# Altium project P9XV1.0.PrjPCB (part 1 of 2)
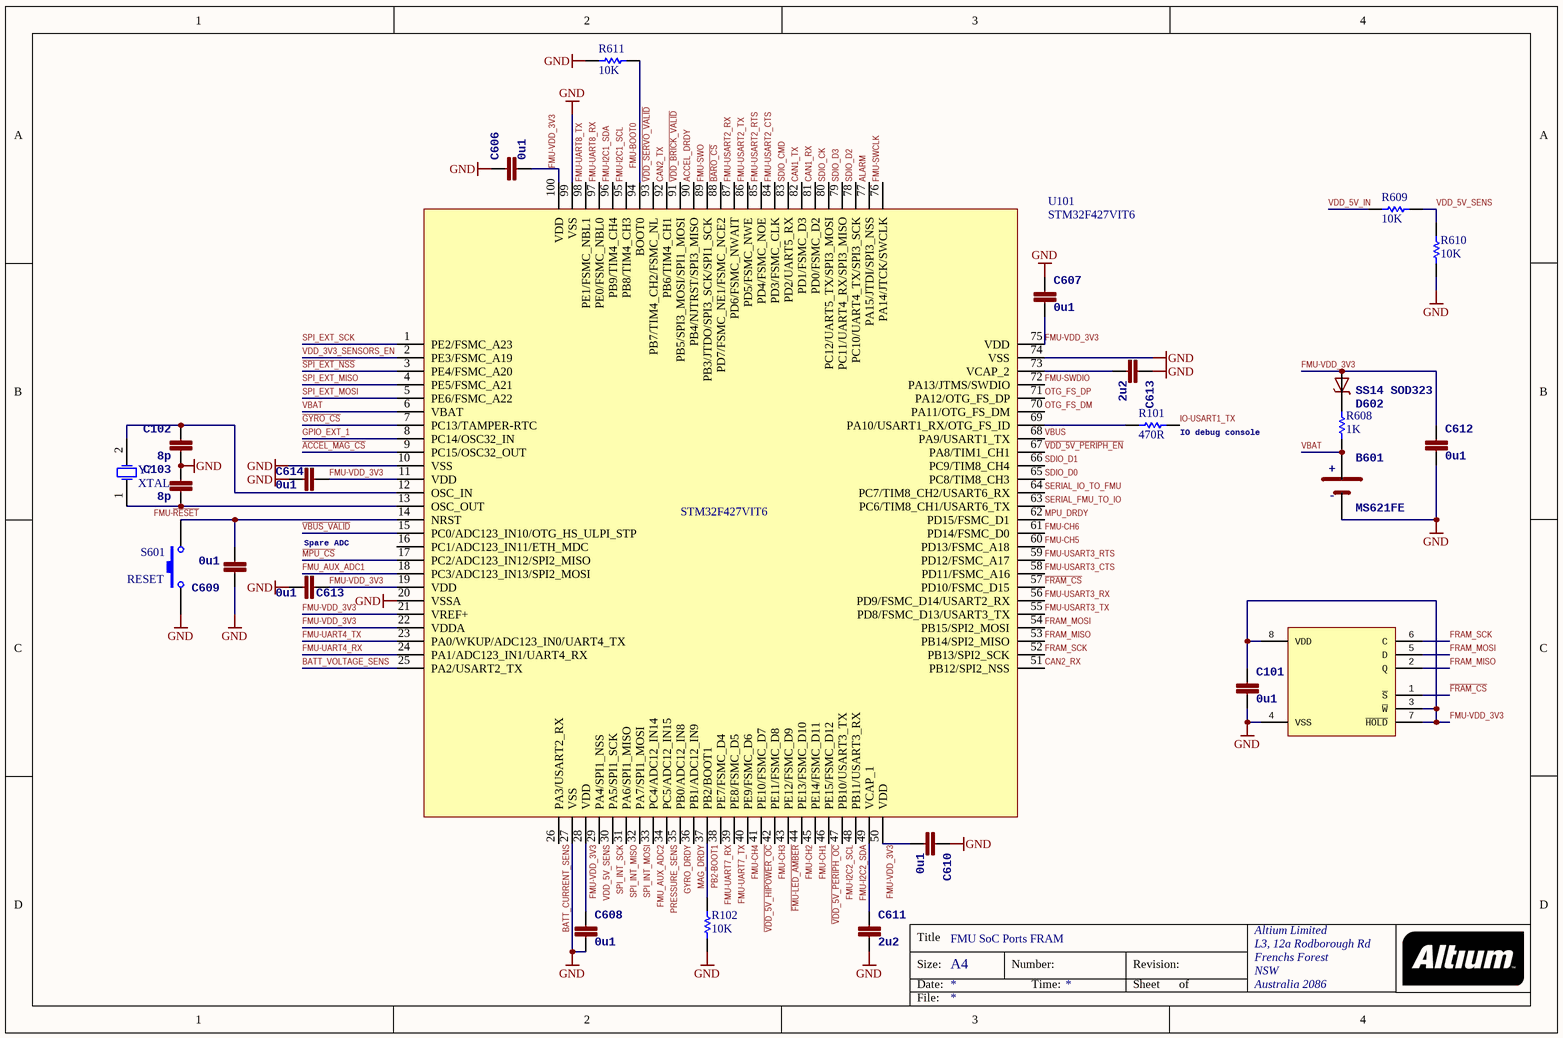
[diagram p0: F217Soc.SchDoc]
10 sheets, 241 parts. Net scope: global (net labels, ports and power ports of the same name join across sheets).
Board file: P9XV1.0.PcbDoc
Sheets:
  F217Soc.SchDoc
  FMU IO ports.SchDoc
  IMU.SchDoc
  F427&IMU Power Supply.SchDoc
  LEDs etc.SchDoc
  F100SoC.SchDoc
  Servo interface.SchDoc
  IO Power Supply.SchDoc
  Power SUM.SchDoc
  Test and Fiducials.SchDoc

## Sheet F217Soc.SchDoc
size A4; Organization: Altium Limited; Address1: L3, 12a Rodborough Rd; Address2: Frenchs Forest; Address3: NSW; Address4: Australia 2086

### Parts
(Parts that share a designator on the sheet are numbered #1, #2 ... from top to bottom, then left to right.)
B601  >NAME: B601  [MS621FE]  (hidden comment: MS621FE)
C101  >NAME: C101  [0603-CAP]  (hidden comment: 0u1)
C102  >NAME: C102  [0603-CAP]  (hidden comment: 8p)
C103  >NAME: C103  [0603-CAP]  (hidden comment: 8p)
C606  >NAME: C606  [0603-CAP]  (hidden comment: 0u1)
C607  >NAME: C607  [0603-CAP]  (hidden comment: 0u1)
C608#1  >NAME: C614  [0603-CAP]  (hidden comment: 0u1)
C608#2  >NAME: C613  [0603-CAP]  (hidden comment: 0u1)
C608#3  >NAME: C608  [0603-CAP]  (hidden comment: 0u1)
C609  >NAME: C609  [0603-CAP]  (hidden comment: 0u1)
C610  >NAME: C610  [0603-CAP]  (hidden comment: 0u1)
C611  >NAME: C611  [0603-CAP]  (hidden comment: 2u2)
C612  >NAME: C612  [0603-CAP]  (hidden comment: 0u1)
C613  >NAME: C613  [0603-CAP]  (hidden comment: 2u2)
D602  SS14 SOD323  [SOD323]
R101  value 470R  [AXIAL-0.5]  (hidden comment: Res Semi)
R102  value 10K  [AXIAL-0.5]  (hidden comment: Res Semi)
R608  value 1K  [AXIAL-0.5]  (hidden comment: Res Semi)
R609  value 10K  [AXIAL-0.5]  (hidden comment: Res Semi)
R610  value 10K  [AXIAL-0.5]  (hidden comment: Res Semi)
R611  value 10K  [AXIAL-0.5]  (hidden comment: Res Semi)
S601  RESET  [SPST-2]
U101  STM32F427VIT6
U102  FM25V01  [SO08]  (value not drawn)
Y?#1  XTAL  [R38]

### Nets
GND: B601.2(NEG) C101.P$2 C102.P$2 C103.P$1 C606.P$1 C607.P$1 C608#1.P$2 C608#2.P$1 C608#3.P$2 C609.P$1 C610.P$1 C611.P$2 C612.P$2 C613.P$1 R102.1 R610.1 R611.2 S601.1 U101.10(VSS) U101.20(VSSA) U101.27(VSS) U101.74(VSS) U101.99(VSS) U102.4(VSS)
~{ACCEL_MAG_CS}: U101.9(PC15/OSC32_OUT)
ACCEL_DRDY: U101.90(PB4/NJTRST/SPI3_MISO)
ALARM: U101.77(PA15/JTDI/SPI3_NSS)
~{BARO_CS}: U101.88(PD7/FSMC_NE1/FSMC_NCE2)
BATT_CURRENT_SENS: U101.26(PA3/USART2_RX)
BATT_VOLTAGE_SENS: U101.25(PA2/USART2_TX)
CAN1_RX: U101.81(PD0/FSMC_D2)
CAN1_TX: U101.82(PD1/FSMC_D3)
CAN2_RX: U101.51(PB12/SPI2_NSS)
CAN2_TX: U101.92(PB6/TIM4_CH1)
~{FMU-LED_AMBER}: U101.43(PE12/FSMC_D9)
~{FRAM_CS}: U101.57(PD10/FSMC_D15) U102.1(~{S})
FMU-BOOT0: R611.1 U101.94(BOOT0)
FMU-CH1: U101.45(PE14/FSMC_D11)
FMU-CH2: U101.44(PE13/FSMC_D10)
FMU-CH3: U101.42(PE11/FSMC_D8)
FMU-CH4: U101.40(PE9/FSMC_D6)
FMU-CH5: U101.60(PD13/FSMC_A18)
FMU-CH6: U101.61(PD14/FSMC_D0)
FMU-I2C1_SCL: U101.95(PB8/TIM4_CH3)
FMU-I2C1_SDA: U101.96(PB9/TIM4_CH4)
FMU-I2C2_SCL: U101.47(PB10/USART3_TX)
FMU-I2C2_SDA: U101.48(PB11/USART3_RX)
FMU-SWCLK: U101.76(PA14/JTCK/SWCLK)
FMU-SWDIO: U101.72(PA13/JTMS/SWDIO)
FMU-SWO: U101.89(PB3/JTDO/SPI3_SCK/SPI1_SCK)
FMU-UART4_RX: U101.24(PA1/ADC123_IN1/UART4_RX)
FMU-UART4_TX: U101.23(PA0/WKUP/ADC123_IN0/UART4_TX)
FMU-UART7_RX: U101.38(PE7/FSMC_D4)
FMU-UART7_TX: U101.39(PE8/FSMC_D5)
FMU-UART8_RX: U101.97(PE0/FSMC_NBL0)
FMU-UART8_TX: U101.98(PE1/FSMC_NBL1)
FMU-USART2_CTS: U101.84(PD3/FSMC_CLK)
FMU-USART2_RTS: U101.85(PD4/FSMC_NOE)
FMU-USART2_RX: U101.87(PD6/FSMC_NWAIT)
FMU-USART2_TX: U101.86(PD5/FSMC_NWE)
FMU-USART3_CTS: U101.58(PD11/FSMC_A16)
FMU-USART3_RTS: U101.59(PD12/FSMC_A17)
FMU-USART3_RX: U101.56(PD9/FSMC_D14/USART2_RX)
FMU-USART3_TX: U101.55(PD8/FSMC_D13/USART3_TX)
FMU-VDD_3V3: C101.P$1 C606.P$2 C607.P$2 C608#1.P$1 C608#2.P$2 C608#3.P$1 C610.P$2 C612.P$1 D602.A U101.11(VDD) U101.19(VDD) U101.21(VREF+) U101.22(VDDA) U101.28(VDD) U101.50(VDD) U101.75(VDD) U101.100(VDD) U102.3(~{W}) U102.7(~{HOLD}) U102.8(VDD)
FMU_AUX_ADC1: U101.18(PC3/ADC123_IN13/SPI2_MOSI)
FMU_AUX_ADC2: U101.33(PC4/ADC12_IN14)
FRAM_MISO: U101.53(PB14/SPI2_MISO) U102.2(Q)
FRAM_MOSI: U101.54(PB15/SPI2_MOSI) U102.5(D)
FRAM_SCK: U101.52(PB13/SPI2_SCK) U102.6(C)
~{GYRO_CS}: U101.7(PC13/TAMPER-RTC)
GPIO_EXT_1: U101.8(PC14/OSC32_IN)
GYRO_DRDY: U101.35(PB0/ADC12_IN8)
IO-USART1_TX: R101.1
~{MPU_CS}: U101.17(PC2/ADC123_IN12/SPI2_MISO)
MAG_DRDY: U101.36(PB1/ADC12_IN9)
MPU_DRDY: U101.62(PD15/FSMC_D1)
OTG_FS_DM: U101.70(PA11/OTG_FS_DM)
OTG_FS_DP: U101.71(PA12/OTG_FS_DP)
PB2-BOOT1: R102.2 U101.37(PB2/BOOT1)
PRESSURE_SENS: U101.34(PC5/ADC12_IN15)
~{SPI_EXT_NSS}: U101.3(PE4/FSMC_A20)
SDIO_CK: U101.80(PC12/UART5_TX/SPI3_MOSI)
SDIO_CMD: U101.83(PD2/UART5_RX)
SDIO_D0: U101.65(PC8/TIM8_CH3)
SDIO_D1: U101.66(PC9/TIM8_CH4)
SDIO_D2: U101.78(PC10/UART4_TX/SPI3_SCK)
SDIO_D3: U101.79(PC11/UART4_RX/SPI3_MISO)
SERIAL_FMU_TO_IO: U101.63(PC6/TIM8_CH1/USART6_TX)
SERIAL_IO_TO_FMU: U101.64(PC7/TIM8_CH2/USART6_RX)
SPI_EXT_MISO: U101.4(PE5/FSMC_A21)
SPI_EXT_MOSI: U101.5(PE6/FSMC_A22)
SPI_EXT_SCK: U101.1(PE2/FSMC_A23)
SPI_INT_MISO: U101.31(PA6/SPI1_MISO)
SPI_INT_MOSI: U101.32(PA7/SPI1_MOSI)
SPI_INT_SCK: U101.30(PA5/SPI1_SCK)
~{VBUS_VALID}: U101.15(PC0/ADC123_IN10/OTG_HS_ULPI_STP)
~{VDD_5V_HIPOWER_OC}: U101.41(PE10/FSMC_D7)
~{VDD_5V_PERIPH_EN}: U101.67(PA8/TIM1_CH1)
~{VDD_5V_PERIPH_OC}: U101.46(PE15/FSMC_D12)
~{VDD_BRICK_VALID}: U101.91(PB5/SPI3_MOSI/SPI1_MOSI)
~{VDD_SERVO_VALID}: U101.93(PB7/TIM4_CH2/FSMC_NL)
VBAT: B601.1(POS) R608.1 U101.6(VBAT)
VBUS: U101.68(PA9/USART1_TX)
VDD_3V3_SENSORS_EN: U101.2(PE3/FSMC_A19)
VDD_5V_IN: R609.2  [project net FMU-VDD_5V5]
VDD_5V_SENS: R609.1 R610.2 U101.29(PA4/SPI1_NSS)
NetC102_P$1: C102.P$1 U101.12(OSC_IN) Y?#1.2(OSC2)
NetC103_P$2: C103.P$2 U101.13(OSC_OUT) Y?#1.1(OSC1)
NetC609_P$2: C609.P$2 S601.2 U101.14(NRST)
NetC611_P$1: C611.P$1 U101.49(VCAP_1)
NetC613_P$2: C613.P$2 U101.73(VCAP_2)
NetD602_C: D602.C R608.2
NetR101_2: R101.2 U101.69(PA10/USART1_RX/OTG_FS_ID)

Not connected (* = marked no-connect by the designer): U101 16(PC1/ADC123_IN11/ETH_MDC)

### Notes on the sheet
- (near R101) IO debug console
- (near C608#2) Spare ADC
- FMU SoC Ports FRAM
- Labels drawn without touching a wire or pin: FMU-~{RESET}
- Title
- Size:
- Date:
- A4
- Number:
- Time:
- Revision:
- Sheet
- of
- File:

### Library data of the parts
B601 = MS621FE: <b>SEIKO 6.8mm Rechargeable 3V lithium battery<b> / <br> / <br> / <b>If discontinued or not available, similar devices are available from Panasonic and Sanyo, usually direct replacements.<b>; PARTNO: MS621FE-FL11E; DATASHEET: http://speed.sii.co.jp/data/file_PRODUCT_MASTER_50112_TITLE_IMAGESP.pdf; LINK: http://search.digikey.com/us/en/products/MS621FE-FL11E/728-1057-ND/1889208; MFGPN: MS621FE; +: +; -: -; >VALUE: MS621FE
C101 C606 C607 C608#1-C608#3 C609 C610 C612 = CAP0402: <b>Capacitor</b> / Standard 0603 ceramic capacitor, and 0.1" leaded capacitor.; PARTNO: CC0402ZRY5V7BB104; >VALUE: 0u1
C102 C103 = CAP0402: <b>Capacitor</b> / Standard 0603 ceramic capacitor, and 0.1" leaded capacitor.; PARTNO: C1005C0G1H080C; >VALUE: 8p
C611 C613 = CAP0603: <b>Capacitor</b> / Standard 0603 ceramic capacitor, and 0.1" leaded capacitor.; PARTNO: C1608X6S1C225K080AC; >VALUE: 2u2
D602 = DIODE-SCHOTTKY_SOD323: Schottky barrier diode in DO214AC, e.g. Fairchild SS14.
R101 R102 R608-R611 = Res Semi: Semiconductor Resistor; Published: 8-Jun-2000; LatestRevisionDate: 17-Jul-2002; LatestRevisionNote: Re-released for DXP Platform.; PackageReference: AXIAL-0.5; Publisher: Altium Limited; PackageDescription: Axial Device, Thru-Hole; 2 Leads; 0.5 in Pin Spacing
S601 = SW-PB: Switch; Published: 24-Mar-1999; LatestRevisionDate: 17-Jul-2002; LatestRevisionNote: Re-released for DXP Platform.; PackageReference: SPST-2; Publisher: Altium Limited; PackageDescription: Switch; 2 Leads
U102 = FM25V01: <b>FM25V01 128Kb Serial 3V F-RAM Memory</b>; PARTNO: FM25V01-G; DATASHEET: http://www.ramtron.com/files/datasheets/FM25V01_ds.pdf; LINK: http://www.digikey.com/product-detail/en/FM25V01-GTR/1140-1026-1-ND/2809832; MFGPN: FM25V01
Y?#1 = XTAL: Crystal Oscillator; Published: 8-Jun-2000; LatestRevisionDate: 17-Jul-2002; LatestRevisionNote: Re-released for DXP Platform.; PackageReference: R38; Publisher: Altium Limited; PackageDescription: Crystal, Thru-Hole; 2 Leads; Body 3.1 x 8.2 mm (Dia.xH)

## Sheet FMU IO ports.SchDoc
size A4; Organization: Altium Limited; Address1: L3, 12a Rodborough Rd; Address2: Frenchs Forest; Address3: NSW; Address4: Australia 2086
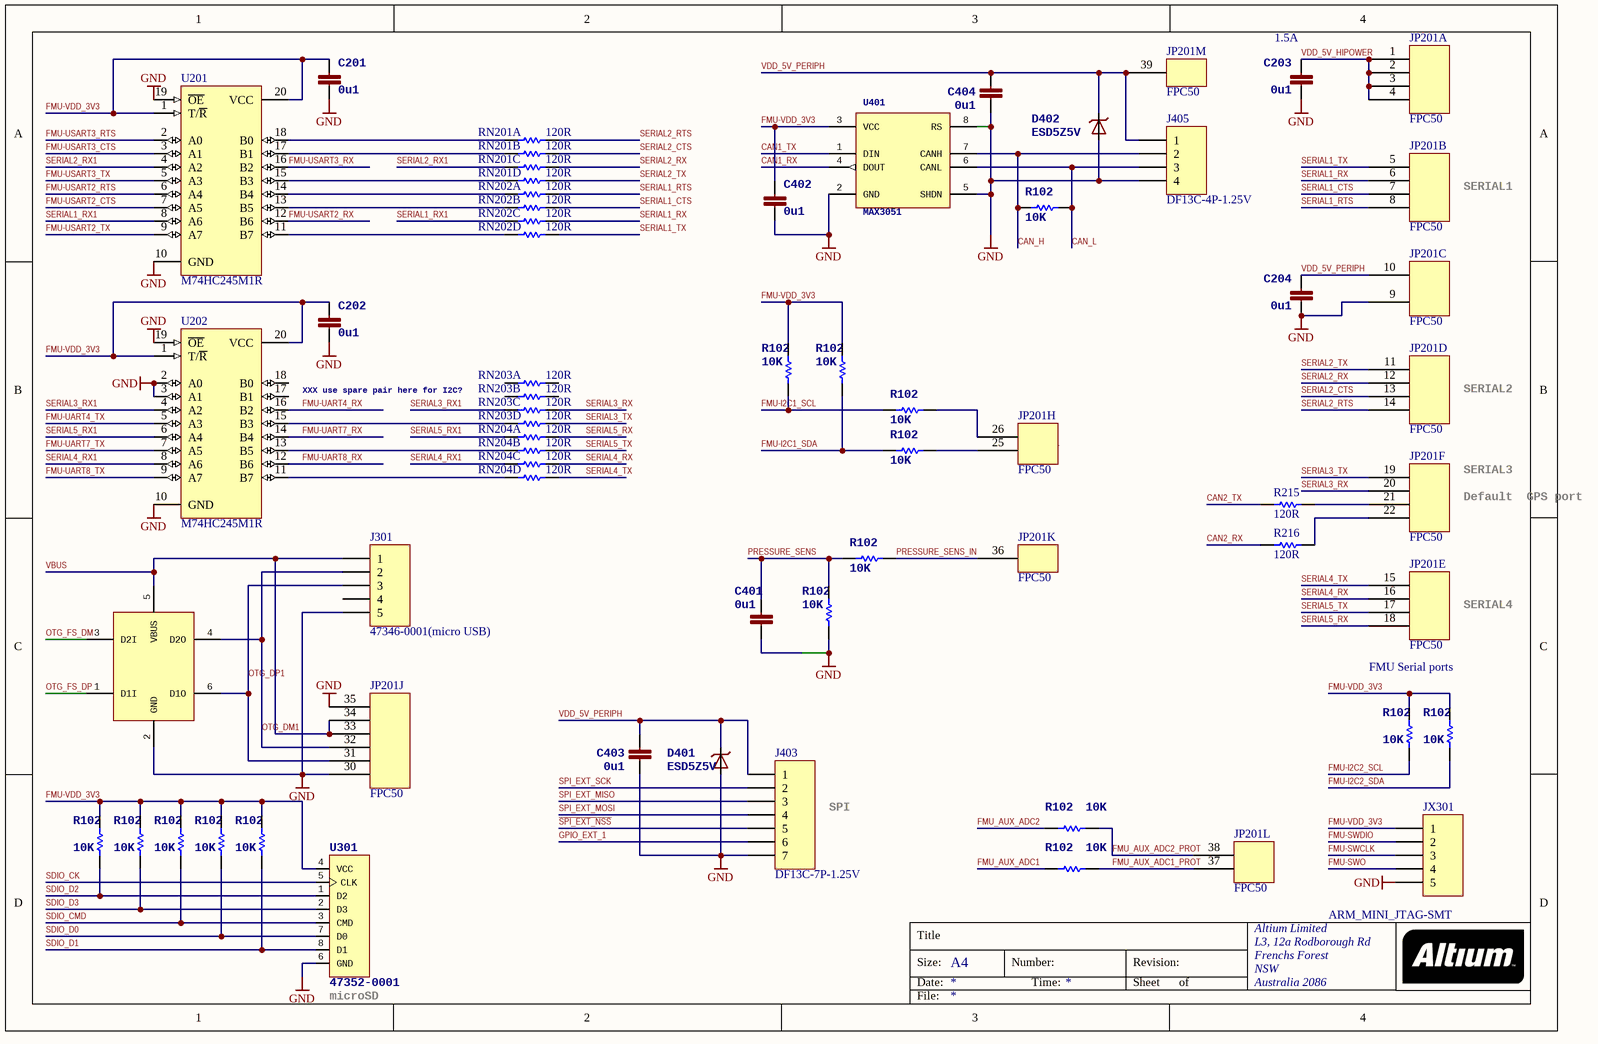
[diagram p1: FMU IO ports.SchDoc]

### Parts
C201  >NAME: C201  [0603-CAP]  (hidden comment: 0u1)
C202  >NAME: C202  [0603-CAP]  (hidden comment: 0u1)
C203  >NAME: C203  [0603-CAP]  (hidden comment: 0u1)
C204  >NAME: C204  [0603-CAP]  (hidden comment: 0u1)
C401  >NAME: C401  [0603-CAP]  (hidden comment: 0u1)
C402  >NAME: C402  [0603-CAP]  (hidden comment: 0u1)
C403  >NAME: C403  [0603-CAP]  (hidden comment: 0u1)
C404  >NAME: C404  [0603-CAP]  (hidden comment: 0u1)
D401  ESD5Z5V  [SOD523]
D402  ESD5Z5V  [SOD523]
J301  47346-0001(micro USB)  [HDR1X5]
J403  DF13C-7P-1.25V  [HDR1X7]
J405  DF13C-4P-1.25V  [HDR1X4]
JP201  FPC50  [FPC-0.5-50下接带锁]  (parts A,B,C,D,E,F,H,J,K,L,M of 16)
JX301  ARM_MINI_JTAG-SMT  [HDR1X5]
R215  value 120R  [AXIAL-0.5]  (hidden comment: Res Semi)
R216  value 120R  [AXIAL-0.5]  (hidden comment: Res Semi)
R301  >NAME: R102  [0603-RES]  (hidden comment: 10K)
R302  >NAME: R102  [0603-RES]  (hidden comment: 10K)
R303  >NAME: R102  [0603-RES]  (hidden comment: 10K)
R304  >NAME: R102  [0603-RES]  (hidden comment: 10K)
R305  >NAME: R102  [0603-RES]  (hidden comment: 10K)
R306  >NAME: R102  [0603-RES]  (hidden comment: 10K)
R307  >NAME: R102  [0603-RES]  (hidden comment: 10K)
R401  >NAME: R102  [0603-RES]  (hidden comment: 10K)
R402  >NAME: R102  [0603-RES]  (hidden comment: 10K)
R403  >NAME: R102  [0603-RES]  (hidden comment: 10K)
R404  >NAME: R102  [0603-RES]  (hidden comment: 10K)
R405  >NAME: R102  [0603-RES]  (hidden comment: 10K)
R406  >NAME: R102  [0603-RES]  (hidden comment: 10K)
R407  >NAME: R102  [0603-RES]  (hidden comment: 10K)
R408  >NAME: R102  [0603-RES]  (hidden comment: 10K)
R409  >NAME: R102  [0603-RES]  (hidden comment: 10K)
RN201A  value 120R  [AXIAL-0.5]  (hidden comment: Res Semi)
RN201B  value 120R  [AXIAL-0.5]  (hidden comment: Res Semi)
RN201C  value 120R  [AXIAL-0.5]  (hidden comment: Res Semi)
RN201D  value 120R  [AXIAL-0.5]  (hidden comment: Res Semi)
RN202A  value 120R  [AXIAL-0.5]  (hidden comment: Res Semi)
RN202B  value 120R  [AXIAL-0.5]  (hidden comment: Res Semi)
RN202C  value 120R  [AXIAL-0.5]  (hidden comment: Res Semi)
RN202D  value 120R  [AXIAL-0.5]  (hidden comment: Res Semi)
RN203A  value 120R  [AXIAL-0.5]  (hidden comment: Res Semi)
RN203B  value 120R  [AXIAL-0.5]  (hidden comment: Res Semi)
RN203C  value 120R  [AXIAL-0.5]  (hidden comment: Res Semi)
RN203D  value 120R  [AXIAL-0.5]  (hidden comment: Res Semi)
RN204A  value 120R  [AXIAL-0.5]  (hidden comment: Res Semi)
RN204B  value 120R  [AXIAL-0.5]  (hidden comment: Res Semi)
RN204C  value 120R  [AXIAL-0.5]  (hidden comment: Res Semi)
RN204D  value 120R  [AXIAL-0.5]  (hidden comment: Res Semi)
U201  M74HC245M1R  [TSSOP20]
U202  M74HC245M1R  [TSSOP20]
U301  >NAME: U301  >VALUE: 47352-0001  [MICROSD]  (hidden comment: 2908-05WB-MG)
U302  NUF2042XV6  [SOT23-6]  (value not drawn)
U401  >NAME: U401  [SOT23-8]  (hidden comment: MAX3051)

### Nets
GND: C201.P$2 C202.P$2 C203.P$2 C204.P$2 C401.P$2 C402.P$2 C403.P$2 C404.P$2 D401.A D402.A J301.5 J403.7 J405.4 JP201.9 JP201.30 JP201.35 JX301.5 R403.P$1 U201.10(GND) U201.19(~{OE}) U202.2(A0) U202.3(A1) U202.10(GND) U202.19(~{OE}) U301.6(GND) U302.2(GND) U401.2(GND) U401.5(SHDN) U401.8(RS)
CAN1_RX: U401.4(DOUT)
CAN1_TX: U401.1(DIN)
CAN2_RX: R216.1
CAN2_TX: R215.1
CAN_H: J405.2 R409.P$1 U401.7(CANH)
CAN_L: J405.3 R409.P$2 U401.6(CANL)
FMU-I2C1_SCL: R401.P$1 R404.P$1
FMU-I2C1_SDA: R402.P$1 R405.P$1
FMU-I2C2_SCL: R306.P$1
FMU-I2C2_SDA: R307.P$1
FMU-SWCLK: JX301.3
FMU-SWDIO: JX301.2
FMU-SWO: JX301.4
FMU-UART4_RX: U202.16(B2)
FMU-UART4_TX: U202.5(A3)
FMU-UART7_RX: U202.14(B4)
FMU-UART7_TX: U202.7(A5)
FMU-UART8_RX: U202.12(B6)
FMU-UART8_TX: U202.9(A7)
FMU-USART2_CTS: U201.7(A5)
FMU-USART2_RTS: U201.6(A4)
FMU-USART2_RX: U201.12(B6)
FMU-USART2_TX: U201.9(A7)
FMU-USART3_CTS: U201.3(A1)
FMU-USART3_RTS: U201.2(A0)
FMU-USART3_RX: U201.16(B2)
FMU-USART3_TX: U201.5(A3)
FMU-VDD_3V3: C201.P$1 C202.P$1 C402.P$1 JX301.1 R301.P$2 R302.P$2 R303.P$2 R304.P$2 R305.P$2 R306.P$2 R307.P$2 R401.P$2 R402.P$2 U201.1(T/~{R}) U201.20(VCC) U202.1(T/~{R}) U202.20(VCC) U301.4(VCC) U401.3(VCC)
FMU_AUX_ADC1: R408.P$1
FMU_AUX_ADC1_PROT: JP201.37 R408.P$2
FMU_AUX_ADC2: R407.P$1
FMU_AUX_ADC2_PROT: JP201.38 R407.P$2
GPIO_EXT_1: J403.6
OTG_DM1: J301.2 JP201.32 U302.4(D2O)
OTG_DP1: J301.3 JP201.31 U302.6(D1O)
OTG_FS_DM: U302.3(D2I)
OTG_FS_DP: U302.1(D1I)
PRESSURE_SENS: C401.P$1 R403.P$2 R406.P$1
PRESSURE_SENS_IN: JP201.36 R406.P$2
~{SPI_EXT_NSS}: J403.5
SDIO_CK: U301.5(CLK)
SDIO_CMD: R303.P$1 U301.3(CMD)
SDIO_D0: R304.P$1 U301.7(D0)
SDIO_D1: R305.P$1 U301.8(D1)
SDIO_D2: R301.P$1 U301.1(D2)
SDIO_D3: R302.P$1 U301.2(D3)
SERIAL1_CTS: JP201.7 RN202B.1
SERIAL1_RTS: JP201.8 RN202A.1
SERIAL1_RX: JP201.6 RN202C.1
SERIAL1_RX1: RN202C.2 U201.8(A6)
SERIAL1_TX: JP201.5 RN202D.1
SERIAL2_CTS: JP201.13 RN201B.1
SERIAL2_RTS: JP201.14 RN201A.1
SERIAL2_RX: JP201.12 RN201C.1
SERIAL2_RX1: RN201C.2 U201.4(A2)
SERIAL2_TX: JP201.11 RN201D.1
SERIAL3_RX: JP201.20 RN203C.1
SERIAL3_RX1: RN203C.2 U202.4(A2)
SERIAL3_TX: JP201.19 RN203D.1
SERIAL4_RX: JP201.16 RN204C.1
SERIAL4_RX1: RN204C.2 U202.8(A6)
SERIAL4_TX: JP201.15 RN204D.1
SERIAL5_RX: JP201.18 RN204A.1
SERIAL5_RX1: RN204A.2 U202.6(A4)
SERIAL5_TX: JP201.17 RN204B.1
SPI_EXT_MISO: J403.3
SPI_EXT_MOSI: J403.4
SPI_EXT_SCK: J403.2
VBUS: J301.1 JP201.33 JP201.34 U302.5(VBUS)
VDD_5V_HIPOWER: C203.P$1 JP201.1 JP201.2 JP201.3 JP201.4
VDD_5V_PERIPH: C204.P$1 C403.P$1 C404.P$1 D401.C D402.C J403.1 J405.1 JP201.10 JP201.39
NetJP201_21: JP201.21 R215.2
NetJP201_22: JP201.22 R216.2
NetJP201_25: JP201.25 R405.P$2
NetJP201_26: JP201.26 R404.P$2
NetRN201A_2: RN201A.2 U201.18(B0)
NetRN201B_2: RN201B.2 U201.17(B1)
NetRN201D_2: RN201D.2 U201.15(B3)
NetRN202A_2: RN202A.2 U201.14(B4)
NetRN202B_2: RN202B.2 U201.13(B5)
NetRN202D_2: RN202D.2 U201.11(B7)
NetRN203D_2: RN203D.2 U202.15(B3)
NetRN204B_2: RN204B.2 U202.13(B5)
NetRN204D_2: RN204D.2 U202.11(B7)

Not connected (* = marked no-connect by the designer): J301 4; RN203A 1 2; RN203B 1 2; U202 17(B1) 18(B0)

### Notes on the sheet
- (near C203) 1.5A
- SERIAL1
- XXX use spare pair here for I2C?
- (near JP201) I2C1
- SERIAL2
- SERIAL3
- Default
  GPS port
- SERIAL4
- FMU Serial ports
- SPI
- (near U301) microSD
- Title
- Size:
- Date:
- A4
- Number:
- Time:
- Revision:
- Sheet
- of
- File:

### Library data of the parts
C201 C202 C401 C402 = CAP0402: as C101 on sheet F217Soc; >VALUE: 0u1
C203 C204 C403 C404 = CAP0805: <b>Capacitor</b> / Standard 0603 ceramic capacitor, and 0.1" leaded capacitor.; PARTNO: CC0805ZKY5V6BB106; >VALUE: 0u1
D401 D402 = DIODE-TVS
J301 JX301 = Header 5: Header, 5-Pin; LatestRevisionDate: 17-Jul-2002; LatestRevisionNote: Re-released for DXP Platform.; Publisher: Altium Limited
J403 = Header 7: Header, 7-Pin; LatestRevisionDate: 17-Jul-2002; LatestRevisionNote: Re-released for DXP Platform.; Publisher: Altium Limited
J405 = Header 4: Header, 4-Pin; LatestRevisionDate: 17-Jul-2002; LatestRevisionNote: Re-released for DXP Platform.; Publisher: Altium Limited
R215 R216 RN201A RN201B RN201C RN201D RN202A RN202B RN202C RN202D RN203A RN203B RN203C RN203D RN204A RN204B RN204C RN204D = Res Semi: Semiconductor Resistor; Published: 8-Jun-2000; LatestRevisionDate: 17-Jul-2002; LatestRevisionNote: Re-released for DXP Platform.; PackageReference: AXIAL-0.5; Publisher: Altium Limited; PackageDescription: Axial Device, Thru-Hole; 2 Leads; 0.5 in Pin Spacing
R301-R307 R401-R409 = RESISTOR0402-RES: <b>Resistor</b> / Basic schematic elements and footprints for 0603, 1206, and PTH 1/10th watt (small) resistors.; PARTNO: RC0402FR-0710KL; >VALUE: 10K
U201 U202 = M74HC245M1R: Octal Bus Transceiver 3-State Non-Inverting; Published: 8-Jun-2000; LatestRevisionDate: 13-Apr-2006; LatestRevisionNote: IPC-7351 Footprint Added.; DatasheetVersion: Oct-1993; PackageVersion: Jul-2001; PackageReference: SO20; Publisher: Altium Limited; PackageDescription: 20-Pin Plastic Small Outline Integrated Circuit 1.27 mm Pitch; Code_JEDEC: MS-013-AC; Code_IPC: SOIC127P1030-20; ComponentLink1Description: Manufacturer Link; ComponentLink1URL: http://www.st.com/; ComponentLink2Description: Datasheet; ComponentLink2URL: http://www.st.com/stonline/products/literature/ds/1930/m74hc245.pdf
U301 = MICROSDSDI: PARTNO: 2908-05WB-MG
U302 = NUF2042XV6: PARTNO: NUF2042XV6T1G
U401 = MAX3051MAX3051EKA: 3.3-V CAN TRANSCEIVER; PARTNO: MAX3051EKA; >VALUE: MAX3051

## Sheet IMU.SchDoc
size A4; Organization: Altium Limited; Address1: L3, 12a Rodborough Rd; Address2: Frenchs Forest; Address3: NSW; Address4: Australia 2086
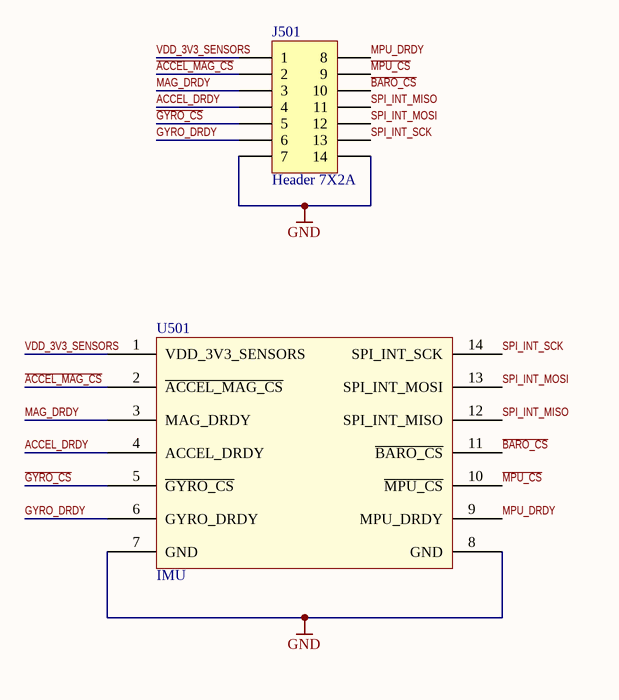
[diagram p2: IMU.SchDoc]

### Parts
J501  Header 7X2A  [smt connecter1.27-15]
U501  IMU  [IMU]

### Nets
GND: J501.7 J501.14 U501.7(GND) U501.8(GND)
~{ACCEL_MAG_CS}: J501.2 U501.2(~{ACCEL_MAG_CS})
ACCEL_DRDY: J501.4 U501.4(ACCEL_DRDY)
~{BARO_CS}: J501.10 U501.11(~{BARO_CS})
~{GYRO_CS}: J501.5 U501.5(~{GYRO_CS})
GYRO_DRDY: J501.6 U501.6(GYRO_DRDY)
~{MPU_CS}: J501.9 U501.10(~{MPU_CS})
MAG_DRDY: J501.3 U501.3(MAG_DRDY)
MPU_DRDY: J501.8 U501.9(MPU_DRDY)
SPI_INT_MISO: J501.11 U501.12(SPI_INT_MISO)
SPI_INT_MOSI: J501.12 U501.13(SPI_INT_MOSI)
SPI_INT_SCK: J501.13 U501.14(SPI_INT_SCK)
VDD_3V3_SENSORS: J501.1 U501.1(VDD_3V3_SENSORS)

### Notes on the sheet
- Title
- Size:
- Date:
- A4
- Number:
- Time:
- Revision:
- Sheet
- of
- File:

### Library data of the parts
J501 = Header 7X2A: Header, 7-Pin, Dual row; LatestRevisionDate: 17-Jul-2002; LatestRevisionNote: Re-released for DXP Platform.; Publisher: Altium Limited

## Sheet F427&IMU Power Supply.SchDoc
size A4; Organization: Altium Limited; Address1: L3, 12a Rodborough Rd; Address2: Frenchs Forest; Address3: NSW; Address4: Australia 2086
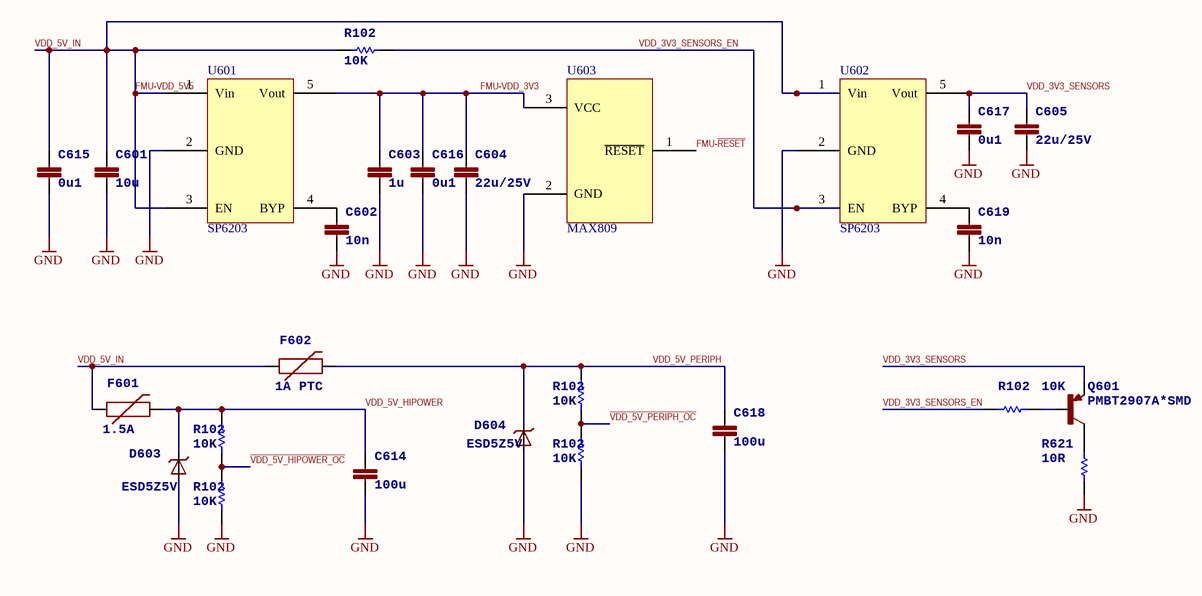
[diagram p3: F427&IMU Power Supply.SchDoc]

### Parts
C601  >NAME: C601  [0805-CAP]  (hidden comment: 10u)
C602  >NAME: C602  [0603-CAP]  (hidden comment: 10n)
C603  >NAME: C603  [0603-CAP]  (hidden comment: 1u)
C604  >NAME: C604  [0805-CAP]  (hidden comment: 22u/25V)
C605  >NAME: C605  [0805-CAP]  (hidden comment: 22u/25V)
C614  >NAME: C614  [1206-CAP]  (hidden comment: 100u)
C615  >NAME: C615  [0603-CAP]  (hidden comment: 0u1)
C616  >NAME: C616  [0603-CAP]  (hidden comment: 0u1)
C617  >NAME: C617  [0603-CAP]  (hidden comment: 0u1)
C618  >NAME: C618  [1206-CAP]  (hidden comment: 100u)
C619  >NAME: C619  [0603-CAP]  (hidden comment: 10n)
D603  ESD5Z5V  [SOD523]
D604  ESD5Z5V  [SOD523]
F601  >NAME: F601  >VALUE: 1.5A  [PTC-1206]  (hidden comment: 2A PTC)
F602  >NAME: F602  [PTC-1206]  (hidden comment: 1A PTC)
Q601  PMBT2907A*SMD  [SOT23-BEC]
R602  >NAME: R102  [0603-RES]  (hidden comment: 10K)
R603  >NAME: R102  [0603-RES]  (hidden comment: 10K)
R604  >NAME: R102  [0603-RES]  (hidden comment: 10K)
R616  >NAME: R102  [0603-RES]  (hidden comment: 10K)
R617  >NAME: R102  [0603-RES]  (hidden comment: 10K)
R620  >NAME: R102  [0603-RES]  (hidden comment: 10K)
R621  >NAME: R621  [0603-RES]  (hidden comment: 10R)
U601  SP6203  [SOT23-5]
U602  SP6203  [SOT23-5]
U603  MAX809  [SOT-23B_N]

### Nets
GND: C601.P$2 C602.P$2 C603.P$2 C604.P$2 C605.P$2 C614.P$2 C615.P$2 C616.P$2 C617.P$2 C618.P$2 C619.P$2 D603.A D604.A R616.P$2 R617.P$2 R621.P$1 U601.2(GND) U602.2(GND) U603.2(GND)
FMU-~{RESET}: U603.1(~{RESET})
FMU-VDD_3V3: C603.P$1 C604.P$1 C616.P$1 U601.5(Vout) U603.3(VCC)
FMU-VDD_5V5: C601.P$1 C615.P$1 F601.1 F602.1 R603.P$1 U601.1(Vin) U601.3(EN) U602.1(Vin)  [also labelled VDD_5V_IN]
~{VDD_5V_HIPOWER_OC}: R602.P$1 R617.P$1
~{VDD_5V_PERIPH_OC}: R604.P$1 R616.P$1
VDD_3V3_SENSORS: C605.P$1 C617.P$1 Q601.E U602.5(Vout)
VDD_3V3_SENSORS_EN: R603.P$2 R620.P$2 U602.3(EN)
VDD_5V_HIPOWER: C614.P$1 D603.C F601.2 R602.P$2
VDD_5V_PERIPH: C618.P$1 D604.C F602.2 R604.P$2
NetC602_P$1: C602.P$1 U601.4(BYP)
NetC619_P$1: C619.P$1 U602.4(BYP)
NetQ601_B: Q601.B R620.P$1
NetQ601_C: Q601.C R621.P$2

### Notes on the sheet
- Title
- Size:
- Date:
- A4
- Number:
- Time:
- Revision:
- Sheet
- of
- File:

### Library data of the parts
C601 C602 C619 = CAP0805: <b>Capacitor</b> / Standard 0603 ceramic capacitor, and 0.1" leaded capacitor.; PARTNO: CL21A106KAYNNNE
  C601: >VALUE: 10u
  C602 C619: >VALUE: 10n
C603 = CAP0603: <b>Capacitor</b> / Standard 0603 ceramic capacitor, and 0.1" leaded capacitor.; PARTNO: CC0603ZRY5V7BB105; >VALUE: 1u
C604 C605 = CAP0805: <b>Capacitor</b> / Standard 0603 ceramic capacitor, and 0.1" leaded capacitor.; PARTNO: CL21A226MAQNNNE; >VALUE: 22u/25V
C614 C618 = CAP1206: <b>Capacitor</b> / Standard 0603 ceramic capacitor, and 0.1" leaded capacitor.; PARTNO: C3216X5R1A107M160AC; >VALUE: 100u
C615-C617 = CAP0402: as C101 on sheet F217Soc; >VALUE: 0u1
D603 D604 = DIODE-TVS
F601 F602 = PTCSMD: <b>Resettable Fuse PTC</b> / Resettable Fuse. Spark Fun Electronics SKU : COM-08357
  F601: PARTNO: 2A PTC
  F602: PARTNO: 1A PTC; >VALUE: 1A PTC
Q601 = MMBT3906*SMD: <b>PNP Transistror</b>
R602-R604 R616 R617 R620 = RESISTOR0402-RES: as R301 on sheet FMU IO ports; >VALUE: 10K
R621 = RESISTOR0603-RES: <b>Resistor</b> / Basic schematic elements and footprints for 0603, 1206, and PTH 1/10th watt (small) resistors.; PARTNO: RC1608J100CS; >VALUE: 10R
U601 U602 = SP6203: LDO with reset

## Sheet LEDs etc.SchDoc
size A4; Organization: Altium Limited; Address1: L3, 12a Rodborough Rd; Address2: Frenchs Forest; Address3: NSW; Address4: Australia 2086
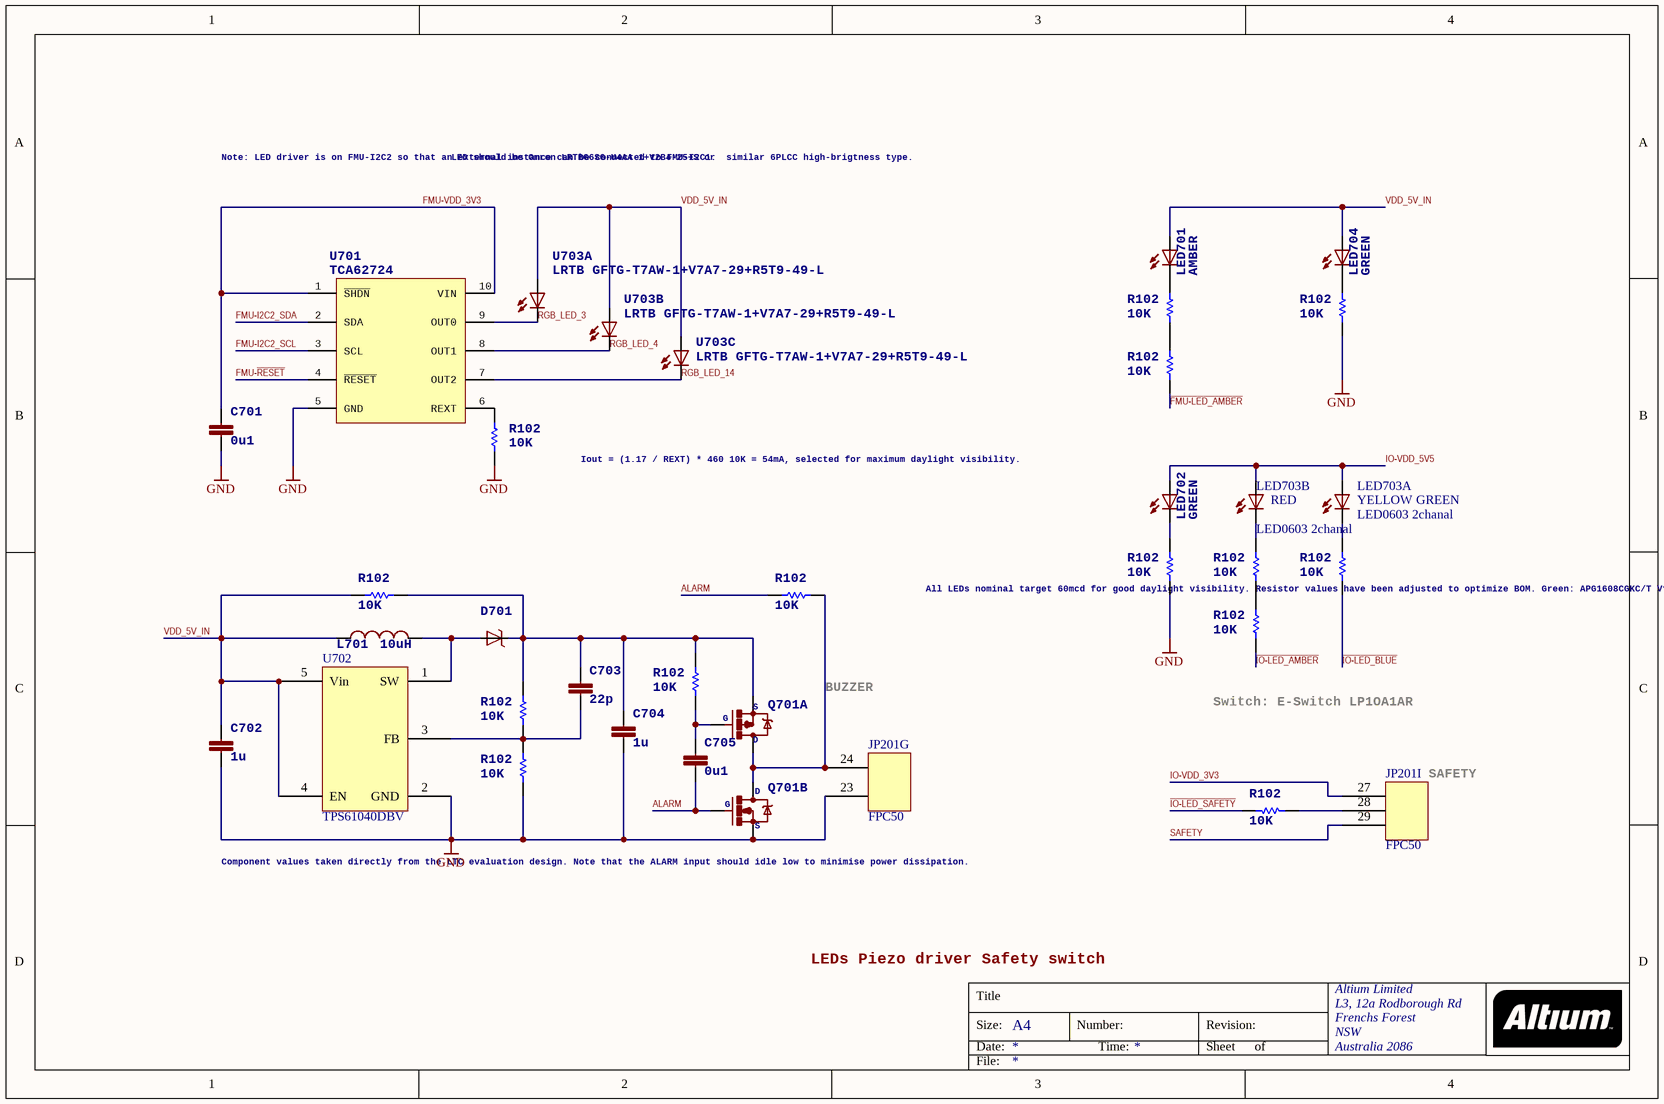
[diagram p4: LEDs etc.SchDoc]

### Parts
C701  >NAME: C701  [0603-CAP]  (hidden comment: 0u1)
C702  >NAME: C702  [0603-CAP]  (hidden comment: 1u)
C703  >NAME: C703  [0603-CAP]  (hidden comment: 22p)
C704  >NAME: C704  [0603-CAP]  (hidden comment: 1u)
C705  >NAME: C705  [0603-CAP]  (hidden comment: 0u1)
D701  SS14 SOD323  [SOD323]  (value not drawn)
JP201  FPC50  [FPC-0.5-50下接带锁]  (parts G,I of 16)
L701  >NAME: L701  [0805-IND]  (hidden comment: 10uH)
LED701  >NAME: LED701  [0603-LED]  (hidden comment: AMBER)
LED702  >NAME: LED702  [0603-LED]  (hidden comment: GREEN)
LED703  LED0603 2chanal  [LED0603 2chanal]  (parts A,B of 2)
LED704  >NAME: LED704  [0603-LED]  (hidden comment: GREEN)
Q701  NX3008CBKS  [SOT363-6]  (value not drawn)  (parts A,B of 2)
R701  >NAME: R102  [0603-RES]  (hidden comment: 10K)
R702  >NAME: R102  [0603-RES]  (hidden comment: 10K)
R703  >NAME: R102  [0603-RES]  (hidden comment: 10K)
R704  >NAME: R102  [0603-RES]  (hidden comment: 10K)
R705  >NAME: R102  [0603-RES]  (hidden comment: 10K)
R706  >NAME: R102  [0603-RES]  (hidden comment: 10K)
R707  >NAME: R102  [0603-RES]  (hidden comment: 10K)
R708  >NAME: R102  [0603-RES]  (hidden comment: 10K)
R709  >NAME: R102  [0603-RES]  (hidden comment: 10K)
R710  >NAME: R102  [0603-RES]  (hidden comment: 10K)
R711  >NAME: R102  [0603-RES]  (hidden comment: 10K)
R712  >NAME: R102  [0603-RES]  (hidden comment: 10K)
R735  >NAME: R102  [0603-RES]  (hidden comment: 10K)
R736  >NAME: R102  [0603-RES]  (hidden comment: 10K)
U701  >NAME: U701  [SON10]  (hidden comment: TCA62724FMG)
U702  TPS61040DBV  [SOT23-5]
U703  LRTB GFTG-T7AW-1+V7A7-29+R5T9-49-L  [6-PLCC]  (parts A,B,C of 3)

### Nets
GND: C701.P$2 C702.P$2 C704.P$2 JP201.23 Q701.1(S) R703.P$2 R704.P$1 R708.P$1 R711.P$1 U701.5(GND) U702.2(GND)
ALARM: C705.P$2 Q701.2(G) R706.P$2
~{FMU-LED_AMBER}: R707.P$1
FMU-I2C2_SCL: U701.3(SCL)
FMU-I2C2_SDA: U701.2(SDA)
FMU-~{RESET}: U701.4(~{RESET})
FMU-VDD_3V3: C701.P$1 U701.1(~{SHDN}) U701.10(VIN)
~{IO-LED_AMBER}: R709.P$1
~{IO-LED_BLUE}: R712.P$1
~{IO-LED_SAFETY}: R710.P$2
IO-VDD_3V3: JP201.27
IO-VDD_5V5: LED702.A LED703.3(A) LED703.4(A)
RGB_LED_3: U701.9(OUT0) U703.C1(C)
RGB_LED_4: U701.8(OUT1) U703.C2(C)
RGB_LED_14: U701.7(OUT2) U703.C3(C)
SAFETY: JP201.29
VDD_5V_IN: C702.P$1 L701.P$1 LED701.A LED704.A R705.P$2 U702.4(EN) U702.5(Vin) U703.A1(A) U703.A2(A) U703.A3(A)  [project net FMU-VDD_5V5]
NetC703_P$1: C703.P$1 C704.P$1 D701.C Q701.4(S) R701.P$1 R702.P$1 R705.P$1
NetC703_P$2: C703.P$2 R702.P$2 R703.P$1 U702.3(FB)
NetC705_P$1: C705.P$1 Q701.5(G) R701.P$2
NetD701_A: D701.A L701.P$2 U702.1(SW)
NetJP201_24: JP201.24 Q701.3(D) Q701.6(D) R706.P$1
NetJP201_28: JP201.28 R710.P$1
NetLED701_C: LED701.C R735.P$2
NetLED702_C: LED702.C R708.P$2
NetLED703_1: LED703.1(C) R712.P$2
NetLED703_2: LED703.2(C) R736.P$2
NetLED704_C: LED704.C R711.P$2
NetR704_P$2: R704.P$2 U701.6(REXT)
NetR707_P$2: R707.P$2 R735.P$1
NetR709_P$2: R709.P$2 R736.P$1

### Notes on the sheet
- Note: LED driver is on FMU-I2C2 so
  that an external instance can be
  connected to FMU-I2C1.
- LED should be Omron LRTBG6SG-U4AA-1+V2B4-25+S or
  similar 6PLCC high-brigtness type.
- Iout = (1.17 / REXT) * 460
  10K = 54mA, selected for maximum
  daylight visibility.
- All LEDs nominal target 60mcd
  for good daylight visibility.
  Resistor values have been adjusted
  to optimize BOM.
  Green: APG1608CGKC/T
  Vf(typ): 2.1V
  Target If: 20mA
  Selected R: 220
  Cacluated If @ 5.5V: 15mA
  Amber: APT1608SECK
  Vf(typ): 2.1V
  Target If: 5mA
  Selected R: 440
  Cacluated If @ 5.5V: 8mA
  Blue: APT1608QBC/G
  Vf(typ): 3.3V
  Target If: 6.6mA
  Selected R: 220
  Cacluated If @ 5.5V: 10mA
- BUZZER
- Switch: E-Switch LP1OA1AR
- (near JP201) SAFETY
- (near Q701) Component values taken directly from
  the LTC evaluation design.
  Note that the ALARM input should idle
  low to minimise power dissipation.
- LEDs
  Piezo driver
  Safety switch
- Title
- Size:
- Date:
- A4
- Number:
- Time:
- Revision:
- Sheet
- of
- File:
- (in symbol LED0603 2chanal, part A) YELLOW GREEN
- (in symbol LED0603 2chanal, part B) RED

### Library data of the parts
C701 C705 = CAP0402: as C101 on sheet F217Soc; >VALUE: 0u1
C702 = CAP0603: as C603 on sheet F427&IMU Power Supply; >VALUE: 1u
C703 = CAP0402: <b>Capacitor</b> / Standard 0603 ceramic capacitor, and 0.1" leaded capacitor.; PARTNO: C0402C562K5RACTU; >VALUE: 22p
C704 = CAP0402: <b>Capacitor</b> / Standard 0603 ceramic capacitor, and 0.1" leaded capacitor.; PARTNO: C1005X5R1C474K050BC; >VALUE: 1u
D701 = DIODE-SCHOTTKY_MSMP: Schottky barrier diode in DO214AC, e.g. Fairchild SS14.
L701 = INDUCTOR0805: <b>Inductors</b> / Basic Inductor/Choke - 0603 and 1210. Footprints are not proven and vary greatly between part numbers. / SRR1210: Bourns SRR1210 parts, e.g. SRR1210-100M; PARTNO: MLZ2012M470W; >VALUE: 10uH
LED701 = LED0603: <b>LEDs</b> / Standard schematic elements and footprints for 5mm, 3mm, 1206, and 0603 sized LEDs. 5mm - Spark Fun Electronics SKU : COM-00529 (and others); PARTNO: APTD1608SECK; >VALUE: AMBER
LED702 LED704 = LED0603: <b>LEDs</b> / Standard schematic elements and footprints for 5mm, 3mm, 1206, and 0603 sized LEDs. 5mm - Spark Fun Electronics SKU : COM-00529 (and others); PARTNO: APTD1608CGCK; >VALUE: GREEN
Q701 = N/PCHANNEL-Complementary-MOSFET: PARTNO: NTHD4102PT1G; D: D; S: S; G: G
R701-R712 R735 R736 = RESISTOR0402-RES: as R301 on sheet FMU IO ports; >VALUE: 10K
U701 = TCA62724FMG: Toshiba TCA62724FMG I2C RGB LED driver; PARTNO: TCA62724FMG; TCA62724: TCA62724
U702 = TPS61040: Boost
U703 = RGB-LED6-PLCC: RGB LED with separate anode/cathode terminals; PARTNO: LRTB GFTG-T7AW-1+V7A7-29+R5T9-49-L

## Sheet F100SoC.SchDoc
size A4; Organization: Altium Limited; Address1: L3, 12a Rodborough Rd; Address2: Frenchs Forest; Address3: NSW; Address4: Australia 2086
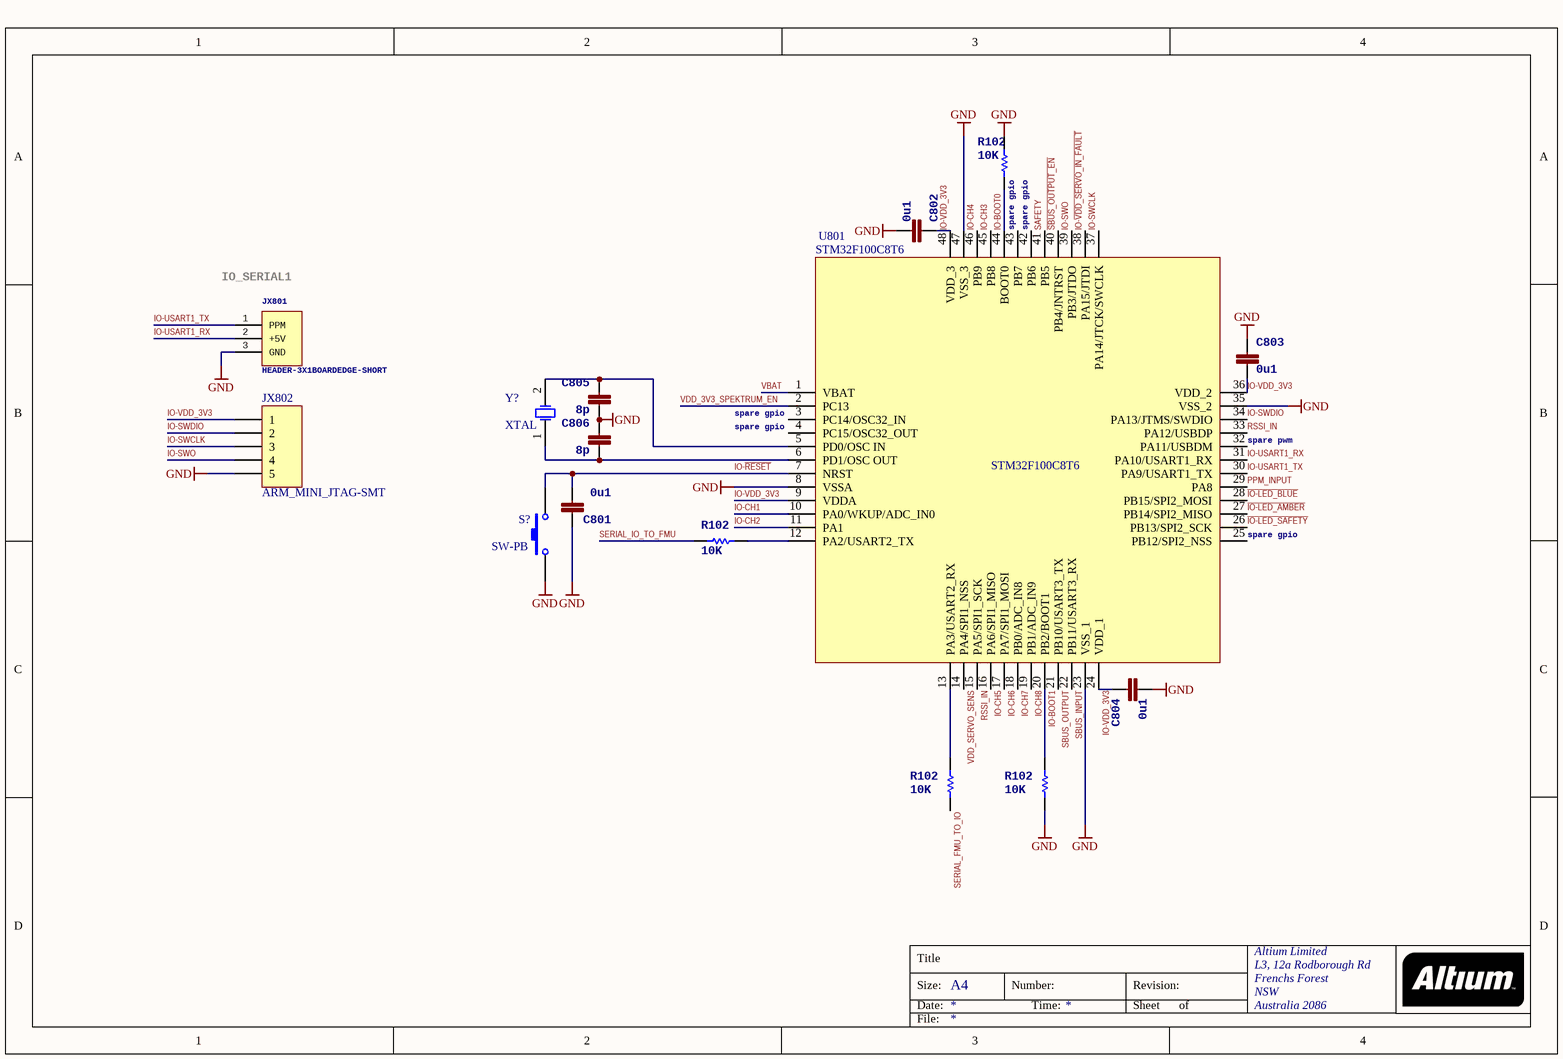
[diagram p5: F100SoC.SchDoc]

### Parts
(Parts that share a designator on the sheet are numbered #1, #2 ... from top to bottom, then left to right.)
C801  >NAME: C801  [0603-CAP]  (hidden comment: 0u1)
C802  >NAME: C802  [0603-CAP]  (hidden comment: 0u1)
C803  >NAME: C803  [0603-CAP]  (hidden comment: 0u1)
C804  >NAME: C804  [0603-CAP]  (hidden comment: 0u1)
C805  >NAME: C805  [0603-CAP]  (hidden comment: 8p)
C806  >NAME: C806  [0603-CAP]  (hidden comment: 8p)
JX801  >NAME: JX801  [HEADER_3X01_SMD_H_BOARD_EDGE_SHORT]  (hidden comment: HEADER-3X1BOARDEDGE-SHORT)
JX802  ARM_MINI_JTAG-SMT  [HDR1X5]
R801  >NAME: R102  [0603-RES]  (hidden comment: 10K)
R802  >NAME: R102  [0603-RES]  (hidden comment: 10K)
R803  >NAME: R102  [0603-RES]  (hidden comment: 10K)
R804  >NAME: R102  [0603-RES]  (hidden comment: 10K)
S?  SW-PB  [SPST-2]
U801  STM32F100C8T6
Y?#2  XTAL  [R38]

### Nets
GND: C801.P$1 C802.P$2 C803.P$1 C804.P$2 C805.P$2 C806.P$1 JX801.3(GND) JX802.5 R801.P$1 R802.P$2 S?.2 U801.8(VSSA) U801.23(VSS_1) U801.35(VSS_2) U801.47(VSS_3)
~{IO-LED_AMBER}: U801.27(PB14/SPI2_MISO)
~{IO-LED_BLUE}: U801.28(PB15/SPI2_MOSI)
~{IO-LED_SAFETY}: U801.26(PB13/SPI2_SCK)
IO-BOOT0: R801.P$2 U801.44(BOOT0)
IO-BOOT1: R802.P$1 U801.20(PB2/BOOT1)
IO-CH1: U801.10(PA0/WKUP/ADC_IN0)
IO-CH2: U801.11(PA1)
IO-CH3: U801.45(PB8)
IO-CH4: U801.46(PB9)
IO-CH5: U801.16(PA6/SPI1_MISO)
IO-CH6: U801.17(PA7/SPI1_MOSI)
IO-CH7: U801.18(PB0/ADC_IN8)
IO-CH8: U801.19(PB1/ADC_IN9)
IO-~{RESET}: C801.P$2 S?.1 U801.7(NRST)
IO-SWCLK: JX802.3 U801.37(PA14/JTCK/SWCLK)
IO-SWDIO: JX802.2 U801.34(PA13/JTMS/SWDIO)
IO-SWO: JX802.4 U801.39(PB3/JTDO)
IO-USART1_RX: JX801.2(+5V) U801.31(PA10/USART1_RX)
IO-USART1_TX: JX801.1(PPM) U801.30(PA9/USART1_TX)
IO-~{VDD_SERVO_IN_FAULT}: U801.38(PA15/JTDI)
IO-VDD_3V3: C802.P$1 C803.P$2 C804.P$1 JX802.1 U801.9(VDDA) U801.24(VDD_1) U801.36(VDD_2) U801.48(VDD_3)
PPM_INPUT: U801.29(PA8)
RSSI_IN: U801.15(PA5/SPI1_SCK) U801.33(PA12/USBDP)
~{SBUS_OUTPUT_EN}: U801.40(PB4/JNTRST)
SAFETY: U801.41(PB5)
SBUS_INPUT: U801.22(PB11/USART3_RX)
SBUS_OUTPUT: U801.21(PB10/USART3_TX)
SERIAL_FMU_TO_IO: R804.P$1
SERIAL_IO_TO_FMU: R803.P$1
VBAT: U801.1(VBAT)
VDD_3V3_SPEKTRUM_EN: U801.2(PC13)
VDD_SERVO_SENS: U801.14(PA4/SPI1_NSS)
NetC805_P$1: C805.P$1 U801.5(PD0/OSC_IN) Y?#2.2(OSC2)
NetC806_P$2: C806.P$2 U801.6(PD1/OSC_OUT) Y?#2.1(OSC1)
NetR803_P$2: R803.P$2 U801.12(PA2/USART2_TX)
NetR804_P$2: R804.P$2 U801.13(PA3/USART2_RX)

Not connected (* = marked no-connect by the designer): U801 3(PC14/OSC32_IN) 4(PC15/OSC32_OUT) 25(PB12/SPI2_NSS) 32(PA11/USBDM) 42(PB6) 43(PB7)

### Notes on the sheet
- (near R801) spare gpio
- spare gpio
- (near JX801) IO_SERIAL1
- (near U801) spare gpio
- (near U801) spare pwm
- Title
- Size:
- Date:
- A4
- Number:
- Time:
- Revision:
- Sheet
- of
- File:

### Library data of the parts
C801-C804 = CAP0402: as C101 on sheet F217Soc; >VALUE: 0u1
C805 C806 = CAP0402: as C102 on sheet F217Soc; >VALUE: 8p
JX801 = HEADER-3X1BOARDEDGE-SHORT: <h3>Single row 0.1" servo header</h3>; BOM: EXCLUDE; >VALUE: HEADER-3X1BOARDEDGE-SHORT
JX802 = Header 5: Header, 5-Pin; LatestRevisionDate: 17-Jul-2002; LatestRevisionNote: Re-released for DXP Platform.; Publisher: Altium Limited
R801-R804 = RESISTOR0402-RES: as R301 on sheet FMU IO ports; >VALUE: 10K
S? = SW-PB: Switch; Published: 24-Mar-1999; LatestRevisionDate: 17-Jul-2002; LatestRevisionNote: Re-released for DXP Platform.; PackageReference: SPST-2; Publisher: Altium Limited; PackageDescription: Switch; 2 Leads
Y?#2 = XTAL: Crystal Oscillator; Published: 8-Jun-2000; LatestRevisionDate: 17-Jul-2002; LatestRevisionNote: Re-released for DXP Platform.; PackageReference: R38; Publisher: Altium Limited; PackageDescription: Crystal, Thru-Hole; 2 Leads; Body 3.1 x 8.2 mm (Dia.xH)

## Sheet Servo interface.SchDoc
size A4; Organization: Altium Limited; Address1: L3, 12a Rodborough Rd; Address2: Frenchs Forest; Address3: NSW; Address4: Australia 2086
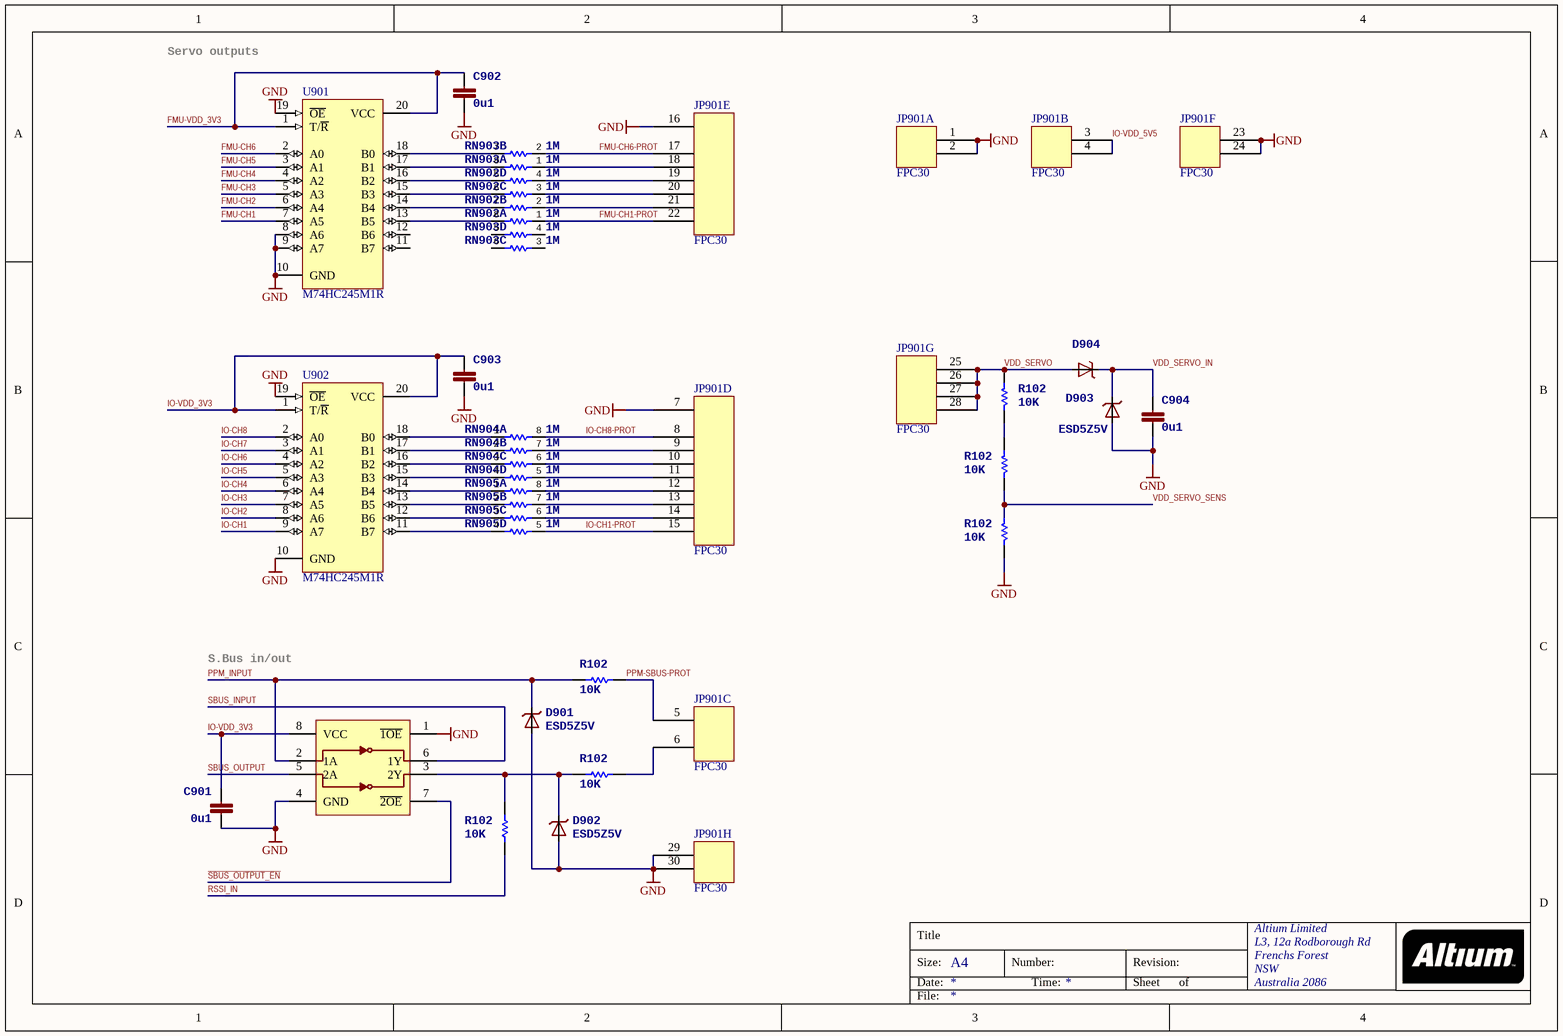
[diagram p6: Servo interface.SchDoc]

### Parts
C901  >NAME: C901  [0603-CAP]  (hidden comment: 0u1)
C902  >NAME: C902  [0603-CAP]  (hidden comment: 0u1)
C903  >NAME: C903  [0603-CAP]  (hidden comment: 0u1)
C904  >NAME: C904  [0603-CAP]  (hidden comment: 0u1)
D901  ESD5Z5V  [SOD523]
D902  ESD5Z5V  [SOD523]
D903  ESD5Z5V  [SOD523]
D904  SS14 SOD323  [SOD323]  (value not drawn)
JP901  FPC30  [FPC-0.5-30下接带锁]  (parts A,B,C,D,E,F,G,H of 8)
R901  >NAME: R102  [0603-RES]  (hidden comment: 10K)
R909  >NAME: R102  [0603-RES]  (hidden comment: 10K)
R910  >NAME: R102  [0603-RES]  (hidden comment: 10K)
R918  >NAME: R102  [0603-RES]  (hidden comment: 10K)
R919  >NAME: R102  [0603-RES]  (hidden comment: 10K)
R922  >NAME: R102  [0603-RES]  (hidden comment: 10K)
RN902  1M  [EXB28V]  (parts A,B,C,D of 4)
RN903  1M  [EXB28V]  (parts A,B,C,D of 4)
RN904  1M  [EXB28V]  (parts A,B,C,D of 4)
RN905  1M  [EXB28V]  (parts A,B,C,D of 4)
U901  M74HC245M1R  [TSSOP20]
U902  M74HC245M1R  [TSSOP20]
U903  74LVC2G240  [TSSOP8_SOT505-2]  (value not drawn)

### Nets
GND: C901.P$2 C902.P$2 C903.P$2 C904.P$2 D901.A D902.A D903.A JP901.1 JP901.2 JP901.7 JP901.16 JP901.23 JP901.24 JP901.29 JP901.30 R919.P$1 U901.8(A6) U901.9(A7) U901.10(GND) U901.19(~{OE}) U902.10(GND) U902.19(~{OE}) U903.1(~{1OE}) U903.4(GND)
FMU-CH1: U901.7(A5)
FMU-CH1-PROT: JP901.22 RN902.1
FMU-CH2: U901.6(A4)
FMU-CH3: U901.5(A3)
FMU-CH4: U901.4(A2)
FMU-CH5: U901.3(A1)
FMU-CH6: U901.2(A0)
FMU-CH6-PROT: JP901.17 RN903.2
FMU-VDD_3V3: C902.P$1 U901.1(T/~{R}) U901.20(VCC)
IO-CH1: U902.9(A7)
IO-CH1-PROT: JP901.15 RN905.5
IO-CH2: U902.8(A6)
IO-CH3: U902.7(A5)
IO-CH4: U902.6(A4)
IO-CH5: U902.5(A3)
IO-CH6: U902.4(A2)
IO-CH7: U902.3(A1)
IO-CH8: U902.2(A0)
IO-CH8-PROT: JP901.8 RN904.8
IO-VDD_3V3: C901.P$1 C903.P$1 U902.1(T/~{R}) U902.20(VCC) U903.8(VCC)
IO-VDD_5V5: JP901.3 JP901.4
PPM-SBUS-PROT: JP901.5 R909.P$2
PPM_INPUT: D901.C R909.P$1 U903.2(1A)
RSSI_IN: R901.P$1
~{SBUS_OUTPUT_EN}: U903.7(~{2OE})
SBUS_INPUT: U903.6(1Y)
SBUS_OUTPUT: U903.5(2A)
VDD_SERVO: D904.A JP901.25 JP901.26 JP901.27 JP901.28 R922.P$2
VDD_SERVO_IN: C904.P$1 D903.C D904.C
VDD_SERVO_SENS: R918.P$1 R919.P$2
NetD902_C: D902.C R901.P$2 R910.P$1 U903.3(2Y)
NetJP901_6: JP901.6 R910.P$2
NetJP901_9: JP901.9 RN904.7
NetJP901_10: JP901.10 RN904.6
NetJP901_11: JP901.11 RN904.5
NetJP901_12: JP901.12 RN905.8
NetJP901_13: JP901.13 RN905.7
NetJP901_14: JP901.14 RN905.6
NetJP901_18: JP901.18 RN903.1
NetJP901_19: JP901.19 RN902.4
NetJP901_20: JP901.20 RN902.3
NetJP901_21: JP901.21 RN902.2
NetR918_P$2: R918.P$2 R922.P$1
NetRN902_5: RN902.5 U901.16(B2)
NetRN902_6: RN902.6 U901.15(B3)
NetRN902_7: RN902.7 U901.14(B4)
NetRN902_8: RN902.8 U901.13(B5)
NetRN903_7: RN903.7 U901.18(B0)
NetRN903_8: RN903.8 U901.17(B1)
NetRN904_1: RN904.1 U902.18(B0)
NetRN904_2: RN904.2 U902.17(B1)
NetRN904_3: RN904.3 U902.16(B2)
NetRN904_4: RN904.4 U902.15(B3)
NetRN905_1: RN905.1 U902.14(B4)
NetRN905_2: RN905.2 U902.13(B5)
NetRN905_3: RN905.3 U902.12(B6)
NetRN905_4: RN905.4 U902.11(B7)

Not connected (* = marked no-connect by the designer): RN903 3(1) 4(1) 5(2) 6(2); U901 11(B7) 12(B6)

### Notes on the sheet
- Servo outputs
- S.Bus in/out
- Title
- Size:
- Date:
- A4
- Number:
- Time:
- Revision:
- Sheet
- of
- File:

### Library data of the parts
C901-C904 = CAP0402: as C101 on sheet F217Soc; >VALUE: 0u1
D901-D903 = DIODE-TVS
D904 = DIODE-SCHOTTKY_MSMP: as D701 on sheet LEDs etc
R901 R909 R910 R918 R919 R922 = RESISTOR0402-RES: as R301 on sheet FMU IO ports; >VALUE: 10K
RN902-RN905 = 4R-NEXB28V: <b>Array Chip Resistor</b><p> / Source: RS Component / Phycomp; PARTNO: EXB-28V105JX; OC_FARNELL: unknown; OC_NEWARK: unknown
U901 U902 = M74HC245M1R: as U201 on sheet FMU IO ports; Published: 8-Jun-2000; LatestRevisionDate: 13-Apr-2006; LatestRevisionNote: IPC-7351 Footprint Added.; DatasheetVersion: Oct-1993; PackageVersion: Jul-2001; PackageReference: SO20; Publisher: Altium Limited; PackageDescription: 20-Pin Plastic Small Outline Integrated Circuit 1.27 mm Pitch; Code_JEDEC: MS-013-AC; Code_IPC: SOIC127P1030-20; ComponentLink1Description: Manufacturer Link; ComponentLink1URL: http://www.st.com/; ComponentLink2Description: Datasheet; ComponentLink2URL: http://www.st.com/stonline/products/literature/ds/1930/m74hc245.pdf
U903 = 74LVC2G240-TSSOP-8: Dual inverter tri-state, 3.3V/5V compatible / <br /> / <a href="http://www.nxp.com/documents/data_sheet/74LVC2G240.pdf">http://www.nxp.com/documents/data_sheet/74LVC2G240.pdf</a><br /> / <a href="http://focus.ti.com/lit/ds/symlink/sn74lvc2g240.pdf">http://focus; PARTNO: 74LVC2G240DP,125

## Sheet IO Power Supply.SchDoc
size A4; Organization: Altium Limited; Address1: L3, 12a Rodborough Rd; Address2: Frenchs Forest; Address3: NSW; Address4: Australia 2086
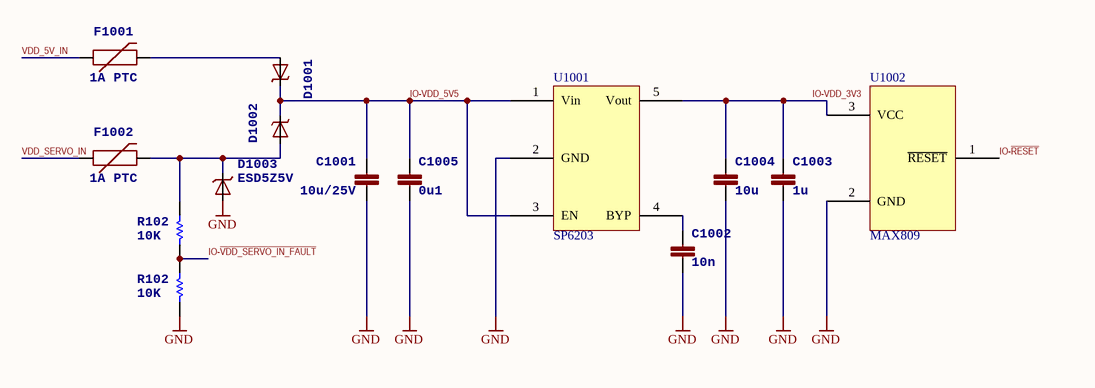
[diagram p7: IO Power Supply.SchDoc]

### Parts
C1001  >NAME: C1001  [0805-CAP]  (hidden comment: 10u/25V)
C1002  >NAME: C1002  [0603-CAP]  (hidden comment: 10n)
C1003  >NAME: C1003  [0603-CAP]  (hidden comment: 1u)
C1004  >NAME: C1004  [0805-CAP]  (hidden comment: 10u)
C1005  >NAME: C1005  [0603-CAP]  (hidden comment: 0u1)
D1001  SS14 SOD323  [SOD323]  (value not drawn)
D1002  SS14 SOD323  [SOD323]  (value not drawn)
D1003  ESD5Z5V  [SOD523]
F1001  >NAME: F1001  [PTC-1206]  (hidden comment: 1A PTC)
F1002  >NAME: F1002  [PTC-1206]  (hidden comment: 1A PTC)
R1001  >NAME: R102  [0603-RES]  (hidden comment: 10K)
R1002  >NAME: R102  [0603-RES]  (hidden comment: 10K)
U1001  SP6203  [SOT23-5]
U1002  MAX809  [SOT-23B_N]

### Nets
GND: C1001.P$2 C1002.P$2 C1003.P$2 C1004.P$2 C1005.P$2 D1003.A R1002.P$1 U1001.2(GND) U1002.2(GND)
IO-~{RESET}: U1002.1(~{RESET})
IO-~{VDD_SERVO_IN_FAULT}: R1001.P$1 R1002.P$2
IO-VDD_3V3: C1003.P$1 C1004.P$1 U1001.5(Vout) U1002.3(VCC)
IO-VDD_5V5: C1001.P$1 C1005.P$1 D1001.C D1002.C U1001.1(Vin) U1001.3(EN)
VDD_5V_IN: F1001.1  [project net FMU-VDD_5V5]
VDD_SERVO_IN: F1002.1
NetC1002_P$1: C1002.P$1 U1001.4(BYP)
NetD1001_A: D1001.A F1001.2
NetD1002_A: D1002.A D1003.C F1002.2 R1001.P$2

### Notes on the sheet
- Title
- Size:
- Date:
- A4
- Number:
- Time:
- Revision:
- Sheet
- of
- File:

### Library data of the parts
C1001 = CAP0805: as C601 on sheet F427&IMU Power Supply; >VALUE: 10u/25V
C1002 C1005 = CAP0402: as C101 on sheet F217Soc
  C1002: >VALUE: 10n
  C1005: >VALUE: 0u1
C1003 = CAP0603: as C603 on sheet F427&IMU Power Supply; >VALUE: 1u
C1004 = CAP0603: <b>Capacitor</b> / Standard 0603 ceramic capacitor, and 0.1" leaded capacitor.; PARTNO: C1608X5R1A106K080AC; >VALUE: 10u
D1001 D1002 = DIODE-SCHOTTKY_MSMP: as D701 on sheet LEDs etc
D1003 = DIODE-TVS
F1001 F1002 = PTCSMD: as F601 on sheet F427&IMU Power Supply; PARTNO: 1A PTC; >VALUE: 1A PTC
R1001 R1002 = RESISTOR0402-RES: as R301 on sheet FMU IO ports; >VALUE: 10K
U1001 = SP6203: LDO with reset

## Sheet Power SUM.SchDoc
size A4; Organization: Altium Limited; Address1: L3, 12a Rodborough Rd; Address2: Frenchs Forest; Address3: NSW; Address4: Australia 2086
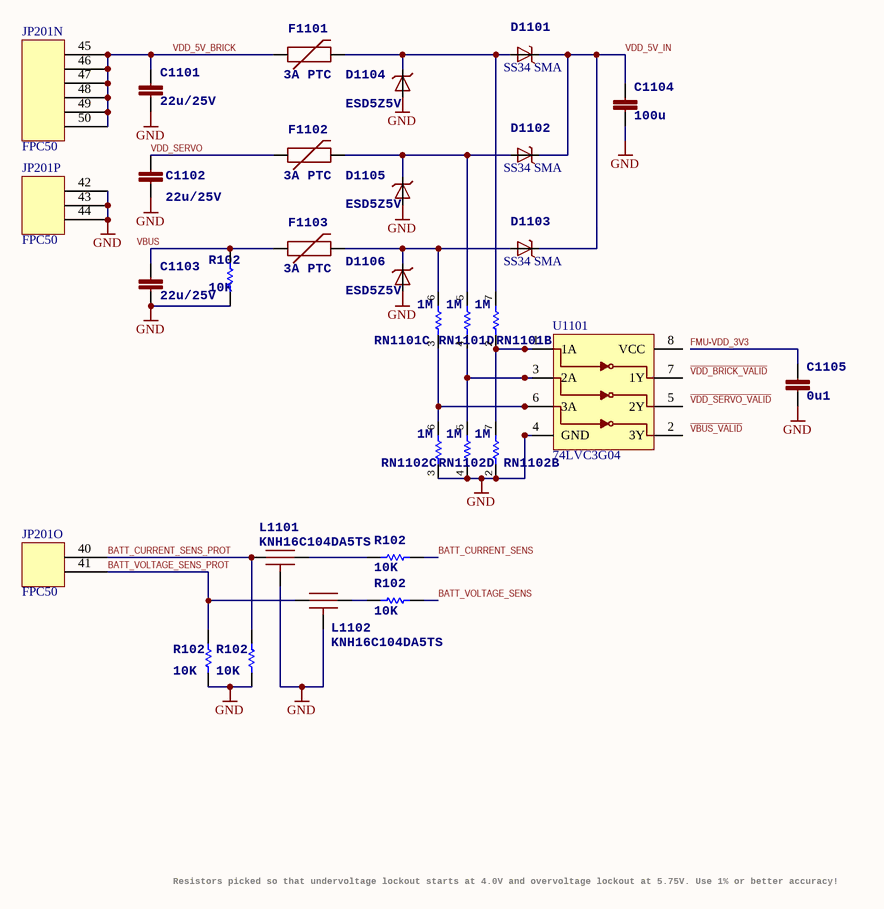
[diagram p8: Power SUM.SchDoc]

### Parts
C1101  >NAME: C1101  [0805-CAP]  (hidden comment: 22u/25V)
C1102  >NAME: C1102  [0805-CAP]  (hidden comment: 22u/25V)
C1103  >NAME: C1103  [0805-CAP]  (hidden comment: 22u/25V)
C1104  >NAME: C1104  [1206-CAP]  (hidden comment: 100u)
C1105  >NAME: C1105  [0603-CAP]  (hidden comment: 0u1)
D1101  SS34 SMA  [SMA]
D1102  SS34 SMA  [SMA]
D1103  SS34 SMA  [SMA]
D1104  ESD5Z5V  [SOD523]
D1105  ESD5Z5V  [SOD523]
D1106  ESD5Z5V  [SOD523]
F1101  >NAME: F1101  [PTC-1206]  (hidden comment: 3A PTC)
F1102  >NAME: F1102  [PTC-1206]  (hidden comment: 3A PTC)
F1103  >NAME: F1103  [PTC-1206]  (hidden comment: 3A PTC)
JP201  FPC50  [FPC-0.5-50下接带锁]  (parts N,O,P of 16)
L1101  KNH16C104DA5TS  [KYOCERA-KNH16-DA]
L1102  KNH16C104DA5TS  [KYOCERA-KNH16-DA]
R1101  >NAME: R102  [0603-RES]  (hidden comment: 10K)
R1102  >NAME: R102  [0603-RES]  (hidden comment: 10K)
R1103  >NAME: R102  [0603-RES]  (hidden comment: 10K)
R1104  >NAME: R102  [0603-RES]  (hidden comment: 10K)
R1105  >NAME: R102  [0603-RES]  (hidden comment: 10K)
RN1101  1M  [EXB28V]  (parts B,C,D of 4)
RN1102  1M  [EXB28V]  (parts B,C,D of 4)
U1101  74LVC3G04  [TSSOP8_SOT505-2]

### Nets
GND: C1101.P$2 C1102.P$2 C1103.P$2 C1104.P$2 C1105.P$2 D1104.A D1105.A D1106.A JP201.42 JP201.43 JP201.44 L1101.P$3_P$4_P$5 L1102.P$3_P$4_P$5 R1103.P$2 R1104.P$2 R1105.P$2 RN1102.2 RN1102.3 RN1102.4 U1101.4(GND)
BATT_CURRENT_SENS: R1101.P$1
BATT_CURRENT_SENS_PROT: JP201.40 L1101.P$1 R1104.P$1
BATT_VOLTAGE_SENS: R1102.P$1
BATT_VOLTAGE_SENS_PROT: JP201.41 L1102.P$1 R1103.P$1
FMU-VDD_3V3: C1105.P$1
VDD_5V_BRICK: C1101.P$1 F1101.1 JP201.45 JP201.46 JP201.47 JP201.48 JP201.49 JP201.50
VDD_5V_IN: C1104.P$1 D1101.C D1102.C D1103.C  [project net FMU-VDD_5V5]
VDD_SERVO: C1102.P$1 F1102.1
NetC1103_P$1: C1103.P$1 F1103.1 R1105.P$1
NetD1101_A: D1101.A D1104.C F1101.2 RN1101.7
NetD1102_A: D1102.A D1105.C F1102.2 RN1101.5
NetD1103_A: D1103.A D1106.C F1103.2 RN1101.6
NetL1101_P$2: L1101.P$2 R1101.P$2
NetL1102_P$2: L1102.P$2 R1102.P$2
NetRN1101_2: RN1101.2 RN1102.7 U1101.1(1A)
NetRN1101_3: RN1101.3 RN1102.6 U1101.6(3A)
NetRN1101_4: RN1101.4 RN1102.5 U1101.3(2A)

Not connected (* = marked no-connect by the designer): U1101 2(3Y) 5(2Y) 7(1Y) 8(VCC)

### Notes on the sheet
- Resistors picked so that undervoltage lockout starts at 4.0V
  and overvoltage lockout at 5.75V.
  Use 1% or better accuracy!
- Labels drawn without touching a wire or pin: VBUS, ~{VBUS_VALID}, ~{VDD_BRICK_VALID}, ~{VDD_SERVO_VALID}
- Title
- Size:
- Date:
- A4
- Number:
- Time:
- Revision:
- Sheet
- of
- File:

### Library data of the parts
C1101-C1103 = CAP0805: as C604 on sheet F427&IMU Power Supply; >VALUE: 22u/25V
C1104 = CAP1206: as C614 on sheet F427&IMU Power Supply; >VALUE: 100u
C1105 = CAP0402: as C101 on sheet F217Soc; >VALUE: 0u1
D1101-D1103 = DIODE-SCHOTTKY_MSMP: as D701 on sheet LEDs etc
D1104-D1106 = DIODE-TVS
F1101-F1103 = PTCSMD: as F601 on sheet F427&IMU Power Supply; PARTNO: 3A PTC; >VALUE: 3A PTC
L1101 L1102 = KNH16C104DA5TS: Kyocera KNH16C104DA5TS EMI filter
R1101-R1105 = RESISTOR0402-RES: as R301 on sheet FMU IO ports; >VALUE: 10K
RN1101 RN1102 = 4R-NEXB28V: as RN902 on sheet Servo interface; OC_FARNELL: unknown; OC_NEWARK: unknown

## Sheet Test and Fiducials.SchDoc
size A4; Organization: Altium Limited; Address1: L3, 12a Rodborough Rd; Address2: Frenchs Forest; Address3: NSW; Address4: Australia 2086
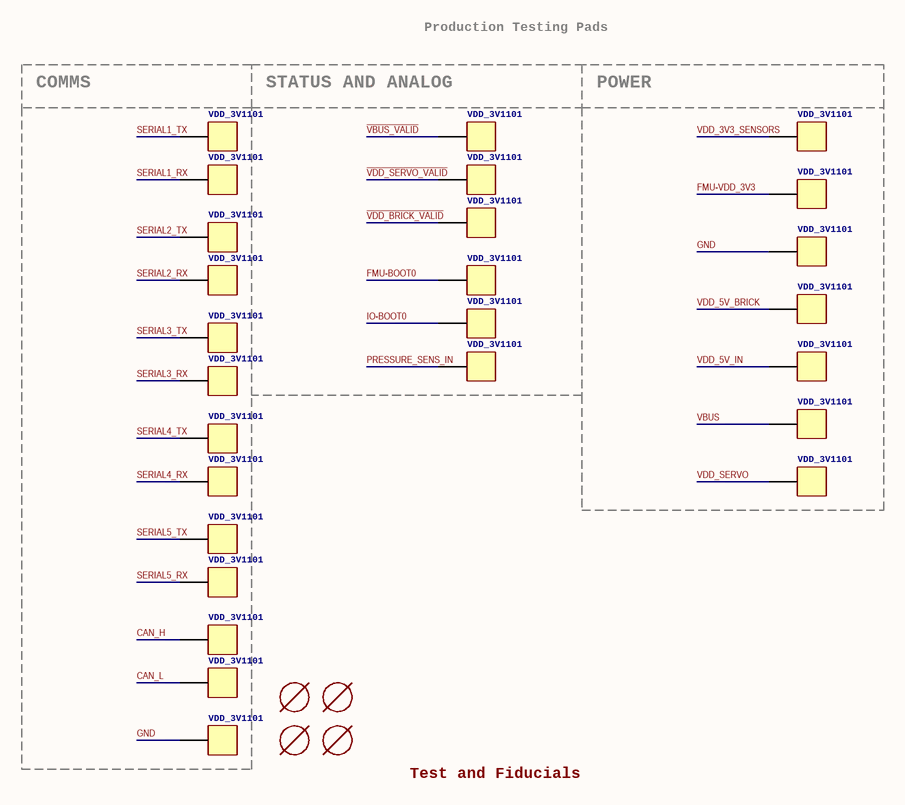
[diagram p9: Test and Fiducials.SchDoc]

### Parts
!VBUS_VALID  >NAME: VDD_3V1101  [PAD.04X.04]  (hidden comment: PAD.04)
!VDD_BRICK_VALID  >NAME: VDD_3V1101  [PAD.04X.04]  (hidden comment: PAD.04)
!VDD_SERVO_VALID  >NAME: VDD_3V1101  [PAD.04X.04]  (hidden comment: PAD.04)
ADC_PR  >NAME: VDD_3V1101  [PAD.04X.04]  (hidden comment: PAD.04)
CAN_H  >NAME: VDD_3V1101  [PAD.04X.04]  (hidden comment: PAD.04)
CAN_L  >NAME: VDD_3V1101  [PAD.04X.04]  (hidden comment: PAD.04)
FMU-BOOT1101  >NAME: VDD_3V1101  [PAD.04X.04]  (hidden comment: PAD.04)
GND  >NAME: VDD_3V1101  [PAD.04X.04]  (hidden comment: PAD.04)
GND.  >NAME: VDD_3V1101  [PAD.04X.04]  (hidden comment: PAD.04)
IO-BOOT1101  >NAME: VDD_3V1101  [PAD.04X.04]  (hidden comment: PAD.04)
M3_MOUNT1101  MOUNT-HOLE3.1MM  [MOUNT-HOLE3.1]  (value not drawn)
M3_MOUNT1102  MOUNT-HOLE3.1MM  [MOUNT-HOLE3.1]  (value not drawn)
M3_MOUNT1103  MOUNT-HOLE3.1MM  [MOUNT-HOLE3.1]  (value not drawn)
M3_MOUNT1104  MOUNT-HOLE3.1MM  [MOUNT-HOLE3.1]  (value not drawn)
S1RX  >NAME: VDD_3V1101  [PAD.04X.04]  (hidden comment: PAD.04)
S1TX  >NAME: VDD_3V1101  [PAD.04X.04]  (hidden comment: PAD.04)
S2RX  >NAME: VDD_3V1101  [PAD.04X.04]  (hidden comment: PAD.04)
S2TX  >NAME: VDD_3V1101  [PAD.04X.04]  (hidden comment: PAD.04)
S3RX  >NAME: VDD_3V1101  [PAD.04X.04]  (hidden comment: PAD.04)
S3TX  >NAME: VDD_3V1101  [PAD.04X.04]  (hidden comment: PAD.04)
S4RX  >NAME: VDD_3V1101  [PAD.04X.04]  (hidden comment: PAD.04)
S4TX  >NAME: VDD_3V1101  [PAD.04X.04]  (hidden comment: PAD.04)
S5_RX  >NAME: VDD_3V1101  [PAD.04X.04]  (hidden comment: PAD.04)
S5_TX  >NAME: VDD_3V1101  [PAD.04X.04]  (hidden comment: PAD.04)
VBUS  >NAME: VDD_3V1101  [PAD.04X.04]  (hidden comment: PAD.04)
VDD_3V1101  >NAME: VDD_3V1101  [PAD.04X.04]  (hidden comment: PAD.04)
VDD_5V_BRICK  >NAME: VDD_3V1101  [PAD.04X.04]  (hidden comment: PAD.04)
VDD_5V_IN  >NAME: VDD_3V1101  [PAD.04X.04]  (hidden comment: PAD.04)
VDD_SERVO  >NAME: VDD_3V1101  [PAD.04X.04]  (hidden comment: PAD.04)
VDDA_3V1101  >NAME: VDD_3V1101  [PAD.04X.04]  (hidden comment: PAD.04)

### Nets
GND: GND.P$1 GND..P$1
CAN_H: CAN_H.P$1
CAN_L: CAN_L.P$1
FMU-BOOT0: FMU-BOOT1101.P$1
FMU-VDD_3V3: VDD_3V1101.P$1
IO-BOOT0: IO-BOOT1101.P$1
PRESSURE_SENS_IN: ADC_PR.P$1
SERIAL1_RX: S1RX.P$1
SERIAL1_TX: S1TX.P$1
SERIAL2_RX: S2RX.P$1
SERIAL2_TX: S2TX.P$1
SERIAL3_RX: S3RX.P$1
SERIAL3_TX: S3TX.P$1
SERIAL4_RX: S4RX.P$1
SERIAL4_TX: S4TX.P$1
SERIAL5_RX: S5_RX.P$1
SERIAL5_TX: S5_TX.P$1
~{VBUS_VALID}: !VBUS_VALID.P$1
~{VDD_BRICK_VALID}: !VDD_BRICK_VALID.P$1
~{VDD_SERVO_VALID}: !VDD_SERVO_VALID.P$1
VBUS: VBUS.P$1
VDD_3V3_SENSORS: VDDA_3V1101.P$1
VDD_5V_BRICK: VDD_5V_BRICK.P$1
VDD_5V_IN: VDD_5V_IN.P$1  [project net FMU-VDD_5V5]
VDD_SERVO: VDD_SERVO.P$1

### Notes on the sheet
- Production Testing Pads
- COMMS
- STATUS AND ANALOG
- POWER
- Test and Fiducials
- Title
- Size:
- Date:
- A4
- Number:
- Time:
- Revision:
- Sheet
- of
- File:

### Library data of the parts
!VBUS_VALID !VDD_BRICK_VALID !VDD_SERVO_VALID ADC_PR CAN_H CAN_L FMU-BOOT1101 GND GND. IO-BOOT1101 S1RX S1TX S2RX S2TX S3RX S3TX S4RX S4TX S5_RX S5_TX VBUS VDD_3V1101 VDD_5V_BRICK VDD_5V_IN VDD_SERVO VDDA_3V1101 = PAD.04: <h3>Test pad</h3> / This footprint includes three classes: The actual test pads, a pogo-pin footprint to mount the pogo-pin as through-hole part and a hole footprint which allows the head of the pogo-pin to pass through (do NOT use the hole to mount the pogo-pin). In a typical test setup, the stack would consist of three PCBs: The actual PCB under testing with a test pad on the bottom, then a second PCB with the hole for the pogo-pin head where the PCB under testing is pressed on and a third PCB at 30 mm / 1.2" distance with the pogo-pin footprints. The pogo-pins are soldered to the last PCB. To create the stack, copy the board under testing and exchange the footprints - this way the correct positioning is ensured.; BOM: EXCLUDE; PARTNO: *
M3_MOUNT1101-M3_MOUNT1104 = MOUNT-HOLE3.1MM: BOM: EXCLUDE; PARTNO: *